# EAGLE design MBHP_CORE_STM32F4 (EAGLE 7.2.0)
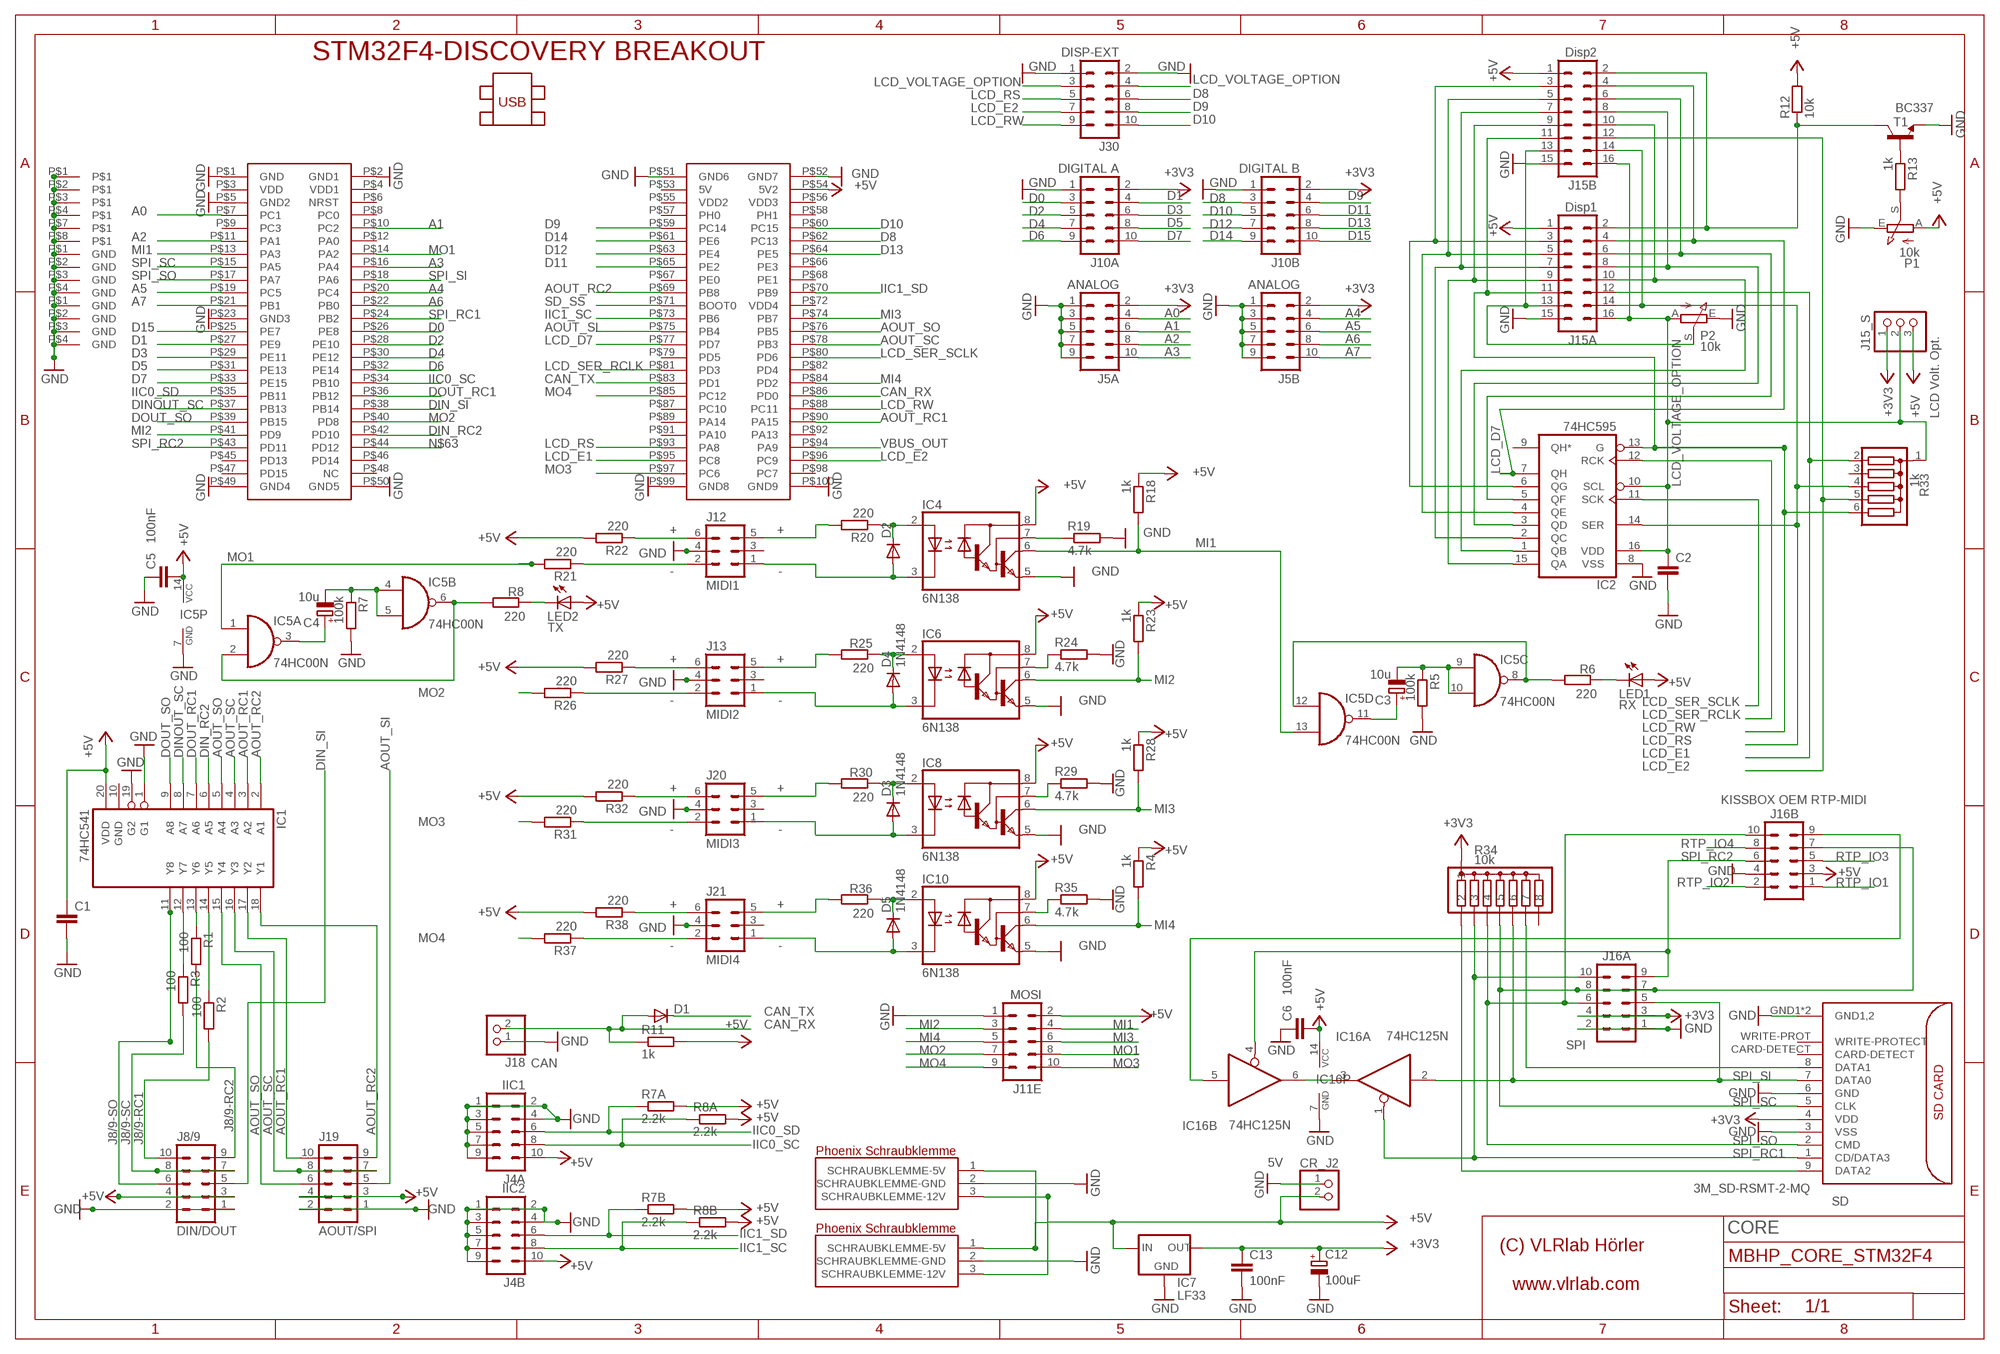
[diagram p0: schematic, sheet 1]

## Parts
C1  C-EU025-025X050  [C025-025X050]
C2  C-EU025-025X050  [C025-025X050]
C3  10u  CPOL-EUE2.5-6  [E2,5-6]
C4  10u  CPOL-EUE2.5-6  [E2,5-6]
C5  100nF  C-EU025-025X050  [C025-025X050]
C6  100nF  C-EU025-025X050  [C025-025X050]
C12  100uF  CPOL-EUE5-10.5  [E5-10,5]
C13  100nF  C-EU025-025X050  [C025-025X050]
CR_J2  5V  PINHD-1X2  [1X02]
D1  1N4148  1N4148DO35-7  [DO35-7]
D2  1N4148DO35-7  [DO35-7]
D3  1N4148  1N4148DO35-7  [DO35-7]
D4  1N4148  1N4148DO35-7  [DO35-7]
D5  1N4148  1N4148DO35-7  [DO35-7]
IC1  74HC541  [DIL20]
IC2  74HC595  [DIL16]
IC4  6N138  6N138DIL  [DIL08]
IC5  74HC00N  74AC00N  [DIL14]
IC6  6N138  6N138DIL  [DIL08]
IC7  LF33  [TO220]
IC8  6N138  6N138DIL  [DIL08]
IC10  6N138  6N138DIL  [DIL08]
IC16  74HC125N  [DIL14]
J1A  PT-1.5/3  [PT-1.5/3-5.0]
J1B  PT-1.5/3  [PT-1.5/3-5.0]
J4A  IIC1  ML10  [ML10]
J4B  IIC2  ML10  [ML10]
J5A  ANALOG  ML10  [ML10]
J5B  ANALOG  ML10  [ML10]
J8/9  DIN/DOUT  ML10  [ML10]
J10A  DIGITAL A  ML10  [ML10]
J10B  DIGITAL B  ML10  [ML10]
J11E  MOSI  ML10  [ML10]
J12  MIDI1  ML6  [ML6]
J13  MIDI2  ML6  [ML6]
J15_S  LCD Volt. Opt.  PINHD-1X3  [1X03]
J15A  Disp1  ML16  [ML16]
J15B  Disp2  ML16  [ML16]
J16A  SPI  ML10  [ML10]
J16B  KISSBOX OEM RTP-MIDI  ML10  [ML10]
J18  CAN  PINHD-1X2  [1X02]
J19  AOUT/SPI  ML10  [ML10]
J20  MIDI3  ML6  [ML6]
J21  MIDI4  ML6  [ML6]
J30  DISP-EXT  ML10  [ML10]
LED1  RX  LED3MM  [LED3MM]
LED2  TX  LED3MM  [LED3MM]
OUTLINE  MIDIBOX_FULL  [MIDIBOX14X12]
P1  10k  PHIER_6MM  [6MM_V]
P2  10k  PHIER_6MM  [6MM_V]
R1  100  R-EU_0204/7  [0204/7]
R2  100  R-EU_0204/7  [0204/7]
R3  100  R-EU_0204/7  [0204/7]
R4  1k  R-EU_0204/7  [0204/7]
R5  100k  R-EU_0204/7  [0204/7]
R6  220  R-EU_0204/7  [0204/7]
R7  100k  R-EU_0204/7  [0204/7]
R7A  2.2k  R-EU_0204/7  [0204/7]
R7B  2.2k  R-EU_0204/7  [0204/7]
R8  220  R-EU_0204/7  [0204/7]
R8A  2.2k  R-EU_0204/7  [0204/7]
R8B  2.2k  R-EU_0204/7  [0204/7]
R11  1k  R-EU_0204/7  [0204/7]
R12  10k  R-EU_0204/7  [0204/7]
R13  1k  R-EU_0204/7  [0204/7]
R18  1k  R-EU_0204/7  [0204/7]
R19  4.7k  R-EU_0204/7  [0204/7]
R20  220  R-EU_0204/7  [0204/7]
R21  220  R-EU_0204/7  [0204/7]
R22  220  R-EU_0204/7  [0204/7]
R23  1k  R-EU_0204/7  [0204/7]
R24  4.7k  R-EU_0204/7  [0204/7]
R25  220  R-EU_0204/7  [0204/7]
R26  220  R-EU_0204/7  [0204/7]
R27  220  R-EU_0204/7  [0204/7]
R28  1k  R-EU_0204/7  [0204/7]
R29  4.7k  R-EU_0204/7  [0204/7]
R30  220  R-EU_0204/7  [0204/7]
R31  220  R-EU_0204/7  [0204/7]
R32  220  R-EU_0204/7  [0204/7]
R33  1k  4306R  [SIL6]
R34  10k  7R_ARRAY  [SIL8]
R35  4.7k  R-EU_0204/7  [0204/7]
R36  220  R-EU_0204/7  [0204/7]
R37  220  R-EU_0204/7  [0204/7]
R38  220  R-EU_0204/7  [0204/7]
SD  3M_SD-RSMT-2-MQ  [3M_SD-RSMT-2-MQ]
STM32F4DISCOVERY  STM32F4-DISCOVERY  [STM32F4-DISCOVERY]
T1  BC337  [TO92]
U$1  KEYSTONE_SCREW_TERMINAL  [KEYSTONE_SCREW_TERMINAL]
U$2  KEYSTONE_SCREW_TERMINAL  [KEYSTONE_SCREW_TERMINAL]

## Nets
+3V3 [SDcard]: C12.+ C13.1 IC7.OUT J5A.2 J5B.2 J10A.2 J10B.2 J15_S.1 J16A.3 J16A.4 R34.1 SD.4(VDD)
+5V [VDD]: C1.1 C5.2 C6.2 CR_J2.2 IC1.20(VDD) IC4.8(VCC) IC5.14(P:VCC) IC6.8(VCC) IC7.IN IC8.8(VCC) IC10.8(VCC) IC16.14(P:VCC) J1A.1(SCHRAUBKLEMME-5V) J1B.1(SCHRAUBKLEMME-5V) J4A.10 J4B.10 J8/9.3 J8/9.4 J11E.2 J15_S.3 J15A.1 J15B.1 J16B.3 J19.3 J19.4 LED1.A LED2.A P1.A R4.1 R7A.2 R7B.2 R8A.2 R8B.2 R11.2 R12.2 R18.1 R22.2 R23.1 R27.2 R28.1 R32.2 R38.2 STM32F4DISCOVERY.P$54(5V2)
+12V1 [10V]: J1A.3(SCHRAUBKLEMME-12V) J1B.3(SCHRAUBKLEMME-12V)
A0: J5A.4 STM32F4DISCOVERY.P$7(PC1)
A1: J5A.6 STM32F4DISCOVERY.P$10(PC2)
A2: J5A.8 STM32F4DISCOVERY.P$11(PA1)
A3: J5A.10 STM32F4DISCOVERY.P$16(PA4)
A4: J5B.4 STM32F4DISCOVERY.P$20(PC4)
A5: J5B.6 STM32F4DISCOVERY.P$19(PC5)
A6: J5B.8 STM32F4DISCOVERY.P$22(PB0)
A7: J5B.10 STM32F4DISCOVERY.P$21(PB1)
AOUT_RC1: IC1.3(A2) IC1.17(Y2) J19.10 STM32F4DISCOVERY.P$90(PA15)
AOUT_RC2: IC1.2(A1) IC1.18(Y1) J19.9 STM32F4DISCOVERY.P$69(PB8)
AOUT_SC: IC1.4(A3) IC1.16(Y3) J19.7 J19.8 STM32F4DISCOVERY.P$78(PB3)
AOUT_SI: J19.5 STM32F4DISCOVERY.P$75(PB4)
AOUT_SO: IC1.5(A4) IC1.15(Y4) J19.6 STM32F4DISCOVERY.P$76(PB5)
CAN_RX: D1.A J18.2 R11.1 STM32F4DISCOVERY.P$86(PD0)
CAN_TX: D1.C STM32F4DISCOVERY.P$83(PD1)
CR_M1-: D2.A IC4.3(C) J12.1
CR_M2+$1: D2.C IC4.2(A) R20.1
D0: J10A.3 STM32F4DISCOVERY.P$26(PE8)
D1: J10A.4 STM32F4DISCOVERY.P$27(PE9)
D2: J10A.5 STM32F4DISCOVERY.P$28(PE10)
D3: J10A.6 STM32F4DISCOVERY.P$29(PE11)
D4: J10A.7 STM32F4DISCOVERY.P$30(PE12)
D5: J10A.8 STM32F4DISCOVERY.P$31(PE13)
D6: J10A.9 STM32F4DISCOVERY.P$32(PE14)
D7: J10A.10 STM32F4DISCOVERY.P$33(PE15)
D8: J10B.3 J30.6 STM32F4DISCOVERY.P$62(PC13)
D9: J10B.4 J30.8 STM32F4DISCOVERY.P$59(PC14)
D10: J10B.5 J30.10 STM32F4DISCOVERY.P$60(PC15)
D11: J10B.6 STM32F4DISCOVERY.P$65(PE2)
D12: J10B.7 STM32F4DISCOVERY.P$63(PE4)
D13: J10B.8 STM32F4DISCOVERY.P$64(PE5)
D14: J10B.9 STM32F4DISCOVERY.P$61(PE6)
D15: J10B.10 STM32F4DISCOVERY.P$25(PE7)
DIN_RC2: IC1.6(A5) STM32F4DISCOVERY.P$42(PD10)
DIN_SI: J8/9.5 STM32F4DISCOVERY.P$38(PB14)
DINOUT_SC: IC1.8(A7) STM32F4DISCOVERY.P$37(PB13)
DOUT_RC1: IC1.7(A6) STM32F4DISCOVERY.P$36(PB12)
DOUT_SO: IC1.9(A8) STM32F4DISCOVERY.P$39(PB15)
GND: C1.2 C2.2 C5.1 C6.1 C12.- C13.2 CR_J2.1 IC1.1(G1) IC1.19(G2) IC2.8(VSS) IC4.5(GND) IC5.7(P:GND) IC6.5(GND) IC7.GND IC8.5(GND) IC10.5(GND) IC16.7(P:GND) J1A.2(SCHRAUBKLEMME-GND) J1B.2(SCHRAUBKLEMME-GND) J4A.1 J4A.2 J4A.3 J4A.4 J4A.5 J4A.7 J4A.9 J4B.1 J4B.2 J4B.3 J4B.4 J4B.5 J4B.7 J4B.9 J5A.1 J5A.3 J5A.5 J5A.7 J5A.9 J5B.1 J5B.3 J5B.5 J5B.7 J5B.9 J8/9.1 J8/9.2 J10A.1 J10B.1 J11E.1 J12.4 J13.4 J15A.15 J15B.15 J16A.1 J16A.2 J16B.4 J18.1 J19.1 J19.2 J20.4 J21.4 J30.1 J30.2 OUTLINE.P$1 OUTLINE.P$2 OUTLINE.P$3 OUTLINE.P$4 OUTLINE.P$7 OUTLINE.P$8 P1.E P2.E R5.2 R7.2 R19.2 R24.2 R29.2 R35.2 SD.3(VSS) SD.6(GND) SD.GND1(GND1,2) SD.GND2(GND1,2) STM32F4DISCOVERY.P$1(GND) STM32F4DISCOVERY.P$2(GND1) STM32F4DISCOVERY.P$5(GND2) STM32F4DISCOVERY.P$23(GND3) STM32F4DISCOVERY.P$49(GND4) STM32F4DISCOVERY.P$50(GND5) STM32F4DISCOVERY.P$51(GND6) STM32F4DISCOVERY.P$52(GND7) STM32F4DISCOVERY.P$99(GND8) STM32F4DISCOVERY.P$100(GND9) T1.1(E) U$1.P$1 U$1.P$2 U$1.P$3 U$1.P$4 U$2.P$1 U$2.P$2 U$2.P$3 U$2.P$4
IIC0_SC: J4A.8 R8A.1 STM32F4DISCOVERY.P$34(PB10)
IIC0_SD: J4A.6 R7A.1 STM32F4DISCOVERY.P$35(PB11)
IIC1_SC: J4B.8 R8B.1 STM32F4DISCOVERY.P$73(PB6)
IIC1_SD: J4B.6 R7B.1 STM32F4DISCOVERY.P$70(PB9)
J8/9-RC1: J8/9.10 R2.2
J8/9-RC2: J8/9.9 R1.2
J8/9-SC: J8/9.7 J8/9.8 R3.2
J8/9-SO: IC1.11(Y8) J8/9.6
LCD_D7: IC2.7(QH) J15A.4 J15B.4 STM32F4DISCOVERY.P$77(PD7)
LCD_E1: J15A.12 R33.2 STM32F4DISCOVERY.P$95(PC8)
LCD_E2: J15B.12 J30.7 R33.5 STM32F4DISCOVERY.P$96(PC9)
LCD_RS: IC2.14(SER) J15A.14 J15B.14 J30.5 R33.4 STM32F4DISCOVERY.P$93(PA8)
LCD_RW: IC2.13(G) J15A.11 J15B.11 J30.9 R33.6 STM32F4DISCOVERY.P$88(PC11)
LCD_SER_RCLK: IC2.12(RCK) STM32F4DISCOVERY.P$81(PD3)
LCD_SER_SCLK: IC2.11(SCK) STM32F4DISCOVERY.P$80(PD6)
LCD_VOLTAGE_OPTION [VDD]: C2.1 IC2.10(SCL) IC2.16(VDD) J15_S.2 J15A.16 J15B.16 J30.3 J30.4 P2.A R33.1
MF_M+ZULEITUNG: J13.5 R25.2
MF_M+ZULEITUNG1: J20.5 R30.2
MF_M+ZULEITUNG2: J21.5 R36.2
MF_M-ZULEITUNG: D4.A IC6.3(C) J13.1
MF_M-ZULEITUNG1: D3.A IC8.3(C) J20.1
MF_M-ZULEITUNG2: D5.A IC10.3(C) J21.1
MI1: IC4.6(VO) IC5.13(D:I1) J11E.4 R18.2 STM32F4DISCOVERY.P$13(PA3)
MI2: IC6.6(VO) J11E.3 R23.2 STM32F4DISCOVERY.P$41(PD9)
MI3: IC8.6(VO) J11E.6 R28.2 STM32F4DISCOVERY.P$74(PB7)
MI4: IC10.6(VO) J11E.5 R4.2 STM32F4DISCOVERY.P$84(PD2)
MO1: IC5.1(A:I0) J11E.8 R21.2 STM32F4DISCOVERY.P$14(PA2)
MO2: J11E.7 R26.2 STM32F4DISCOVERY.P$40(PD8)
MO3: J11E.10 R31.2 STM32F4DISCOVERY.P$97(PC6)
MO4: J11E.9 R37.2 STM32F4DISCOVERY.P$85(PC12)
N$1: IC2.6(QG) J15A.3 J15B.3
N$2: IC2.5(QF) J15A.6 J15B.6
N$3: IC2.4(QE) J15A.5 J15B.5
N$4: IC2.3(QD) J15A.8 J15B.8
N$5: R34.2 SD.9(DATA2)
N$6: IC16.5(B:I) J16B.9
N$7: R34.7 SD.8(DATA1)
N$8: IC2.2(QC) J15A.7 J15B.7
N$9: IC2.1(QB) J15A.10 J15B.10
N$10: IC2.15(QA) J15A.9 J15B.9
N$11: IC4.7(VB) R19.1
N$12: J15A.13 J15B.13 P2.S
N$13: IC16.3(A:O) IC16.6(B:O)
N$14: P1.S R13.2
N$15: R13.1 T1.2(B)
N$16: J12.6 R22.1
N$18: J15A.2 J15B.2 R12.1 T1.3(C)
N$19: D4.C IC6.2(A) R25.1
N$20: J12.5 R20.2
N$21: C3.- IC5.9(C:I0) IC5.10(C:I1) R5.1
N$22: C3.+ IC5.11(D:O)
N$23: IC5.8(C:O) IC5.12(D:I0) R6.2
N$24: J12.3
N$25: J13.6 R27.1
N$26: J13.2 R26.1
N$27: LED1.K(C) R6.1
N$28: D3.C IC8.2(A) R30.1
N$29: IC8.7(VB) R29.1
N$30: J20.6 R32.1
N$31: J20.2 R31.1
N$32: D5.C IC10.2(A) R36.1
N$33: IC10.7(VB) R35.1
N$34: J21.6 R38.1
N$35: J21.2 R37.1
N$36: IC5.4(B:I0) IC5.5(B:I1)
N$37: C4.- R7.1
N$39: C4.+ IC5.3(A:O)
N$40: IC5.2(A:I1) IC5.6(B:O) R8.2
N$42: LED2.K(C) R8.1
N$63: STM32F4DISCOVERY.P$44(PD12)
N$81: J12.2 R21.1
N$99: IC6.7(VB) R24.1
RC-I-: IC1.14(Y5) R2.1
RC-O-: IC1.13(Y6) R1.1
RTP_IO1: J16B.1
RTP_IO2: J16B.2
RTP_IO3: J16B.5
RTP_IO4: J16B.8
SC-: IC1.12(Y7) R3.1
SD_SS: STM32F4DISCOVERY.P$71(BOOT0)
SPI_RC1: IC16.1(A:OE) J16A.10 R34.3 SD.1(CD/DATA3) STM32F4DISCOVERY.P$24(PB2)
SPI_RC2: IC16.4(B:OE) J16A.9 J16B.6 STM32F4DISCOVERY.P$43(PD11)
SPI_SC: J16A.7 J16A.8 J16B.7 R34.5 SD.5(CLK) STM32F4DISCOVERY.P$15(PA5)
SPI_SI: IC16.2(A:I) J16A.5 R34.6 SD.7(DATA0) STM32F4DISCOVERY.P$18(PA6)
SPI_SO: J16A.6 J16B.10 R34.4 SD.2(CMD) STM32F4DISCOVERY.P$17(PA7)
VBUS_OUT: STM32F4DISCOVERY.P$94(PA9)
Unconnected: IC2.9(QH*) IC16.8(C:O) IC16.9(C:I) IC16.10(C:OE) IC16.11(D:O) IC16.12(D:I) IC16.13(D:OE) J13.3 J20.3 J21.3 R33.3 R34.8 SD.CARD-DETECT SD.WRITE-PROT(WRITE-PROTECT) STM32F4DISCOVERY.P$3(VDD) STM32F4DISCOVERY.P$4(VDD1) STM32F4DISCOVERY.P$6(NRST) STM32F4DISCOVERY.P$8(PC0) STM32F4DISCOVERY.P$9(PC3) STM32F4DISCOVERY.P$12(PA0) STM32F4DISCOVERY.P$45(PD13) STM32F4DISCOVERY.P$46(PD14) STM32F4DISCOVERY.P$47(PD15) STM32F4DISCOVERY.P$48(NC) STM32F4DISCOVERY.P$53(5V) STM32F4DISCOVERY.P$55(VDD2) STM32F4DISCOVERY.P$56(VDD3) STM32F4DISCOVERY.P$57(PH0) STM32F4DISCOVERY.P$58(PH1) STM32F4DISCOVERY.P$66(PE3) STM32F4DISCOVERY.P$67(PE0) STM32F4DISCOVERY.P$68(PE1) STM32F4DISCOVERY.P$72(VDD4) STM32F4DISCOVERY.P$79(PD5) STM32F4DISCOVERY.P$82(PD4) STM32F4DISCOVERY.P$87(PC10) STM32F4DISCOVERY.P$89(PA14) STM32F4DISCOVERY.P$91(PA10) STM32F4DISCOVERY.P$92(PA13) STM32F4DISCOVERY.P$98(PC7)

## Notes on the sheet
- + | +
- - | -
- + | +
- - | -
- + | +
- - | -
- + | +
- - | -
- CORE

## Power pins joined to a net without a drawn wire
GND: IC1.10(GND)

## Library data of the parts
C1 C2 C5 C6 C13 = rcl:C-EU: CAPACITOR, European symbol
C3 C4 C12 = rcl:CPOL-EU: POLARIZED CAPACITOR, European symbol
CR_J2 J18 = pinhead_Ivan:PINHD-1X2: PIN HEADER
D1-D5 = diode:1N4148: DIODE high speed (Philips)
IC1 = 595-541-165-uln2803:74HC541
IC2 = 74-595:74HC595
IC4 IC6 IC8 IC10 = 6N138:6N138DIL
IC5 = 74xx-eu:74*00: Quad 2-input NAND gate
IC7 = LF33:LF33
IC16 = 74xx-eu:74*125: Quad bus BUFFER, 3-state
J1A J1B = Phonenix Contacts:PT-1.5/3
J4A J4B J5A J5B J8/9 J10A J10B J11E J16A J16B J19 J30 = con-harting-ml:ML10: HARTING; OC_FARNELL: unknown; OC_NEWARK: unknown
J12 J13 J20 J21 = con-harting-ml:ML6: HARTING; OC_FARNELL: unknown; OC_NEWARK: unknown
J15_S = pinhead_Ivan:PINHD-1X3: PIN HEADER
J15A J15B = con-ml:ML16: HARTING; OC_FARNELL: unknown; OC_NEWARK: unknown
LED1 LED2 = led:LED: LED OSRAM: - CHIPLED LG R971, LG N971, LY N971, LG Q971, LY Q971, LO R971, LY R971 LH N974, LH R974 LS Q976, LO Q976, LY Q976 LO Q996 - Hyper CHIPLED LW Q18S LB Q993, LB Q99A, LB R99A - SideLED LS A670, LO A670, LY A670, LG A670, LP A670 LB A673, LV A673, LT A673, LW A673 LH A674 LY A675 LS A676, LA A676, LO A676, LY A676, LW A676 LS A679, LY A679, LG A679 - Hyper Micro SIDELED® LS Y876, LA Y876, LO Y876, LY Y876 LT Y87S - SmartLED LW L88C, LW L88S LB L89C, LB L89S, LG L890 LS L89K, LO L89K, LY L89K LS L896, LA L896, LO L896, LY L896 - TOPLED LS T670, LO T670, LY T670, LG T670, LP T670 LSG T670, LSP T670, LSY T670, LOP T670, LYG T670 LG T671, LOG T671, LSG T671 LB T673, LV T673, LT T673, LW T673 LH T674 LS T676, LA T676, LO T676, LY T676, LB T676, LH T676, LSB T676, LW T676 LB T67C, LV T67C, LT T67C, LS T67K, LO T67K, LY T67K, LW E67C LS E67B, LA E67B, LO E67B, LY E67B, LB E67C, LV E67C, LT E67C LW T67C LS T679, LY T679, LG T679 LS T770, LO T770, LY T770, LG T770, LP T770 LB T773, LV T773, LT T773, LW T773 LH T774 LS E675, LA E675, LY E675, LS T675 LS T776, LA T776, LO T776, LY T776, LB T776 LHGB T686 LT T68C, LB T68C - Hyper Mini TOPLED® LB M676 - Mini TOPLED Santana® LG M470 LS M47K, LO M47K, LY M47K Source: http://www.osram.convergy.de LUXEON: - LUMILED® LXK2-PW12-R00, LXK2-PW12-S00, LXK2-PW14-U00, LXK2-PW14-V00 LXK2-PM12-R00, LXK2-PM12-S00, LXK2-PM14-U00 LXK2-PE12-Q00, LXK2-PE12-R00, LXK2-PE12-S00, LXK2-PE14-T00, LXK2-PE14-U00 LXK2-PB12-K00, LXK2-PB12-L00, LXK2-PB12-M00, LXK2-PB14-N00, LXK2-PB14-P00, LXK2-PB14-Q00 LXK2-PR12-L00, LXK2-PR12-M00, LXK2-PR14-Q00, LXK2-PR14-R00 LXK2-PD12-Q00, LXK2-PD12-R00, LXK2-PD12-S00 LXK2-PH12-R00, LXK2-PH12-S00 LXK2-PL12-P00, LXK2-PL12-Q00, LXK2-PL12-R00 Source: www.luxeon.com KINGBRIGHT: KA-3528ASYC Source: www.kingbright.com
OUTLINE = Frames_VLR:MIDIBOX_FULL
P1 P2 = Potentiometer 6mm:PHIER_6MM
R1-R3 R7A R7B R8A R8B = rcl:R-EU_: RESISTOR, European symbol
R4-R8 R11-R13 R18-R32 R35-R38 = resistor:R-EU_: RESISTOR, European symbol
R33 = Bourns Resistor Array:4306R
R34 = Bourns Resistor Array:7R_ARRAY
SD = Memory:3M_SD-RSMT-2-MQ
STM32F4DISCOVERY = STM32F4-DISCOVERY:STM32F4-DISCOVERY
T1 = transistor:BC337: NPN TRANSISTOR
U$1 U$2 = holes_Ivan:KEYSTONE_SCREW_TERMINAL

## Net classes
0 default: width 0.254 mm, drill 0.33 mm, clearance 0.254 mm
1 VDD: width 0.61 mm, drill 0.33 mm, clearance 0.406 mm to class 0, clearance 0.406 mm
2 10V: width 1.016 mm, drill 0.33 mm, clearance 0.406 mm to class 0, clearance 0.406 mm to class 1, clearance 0.254 mm
3 SDcard: width 0.406 mm, drill 0.33 mm, clearance 0.406 mm to class 0, clearance 0.406 mm to class 1, clearance 0.406 mm to class 2, clearance 0.406 mm

## Board
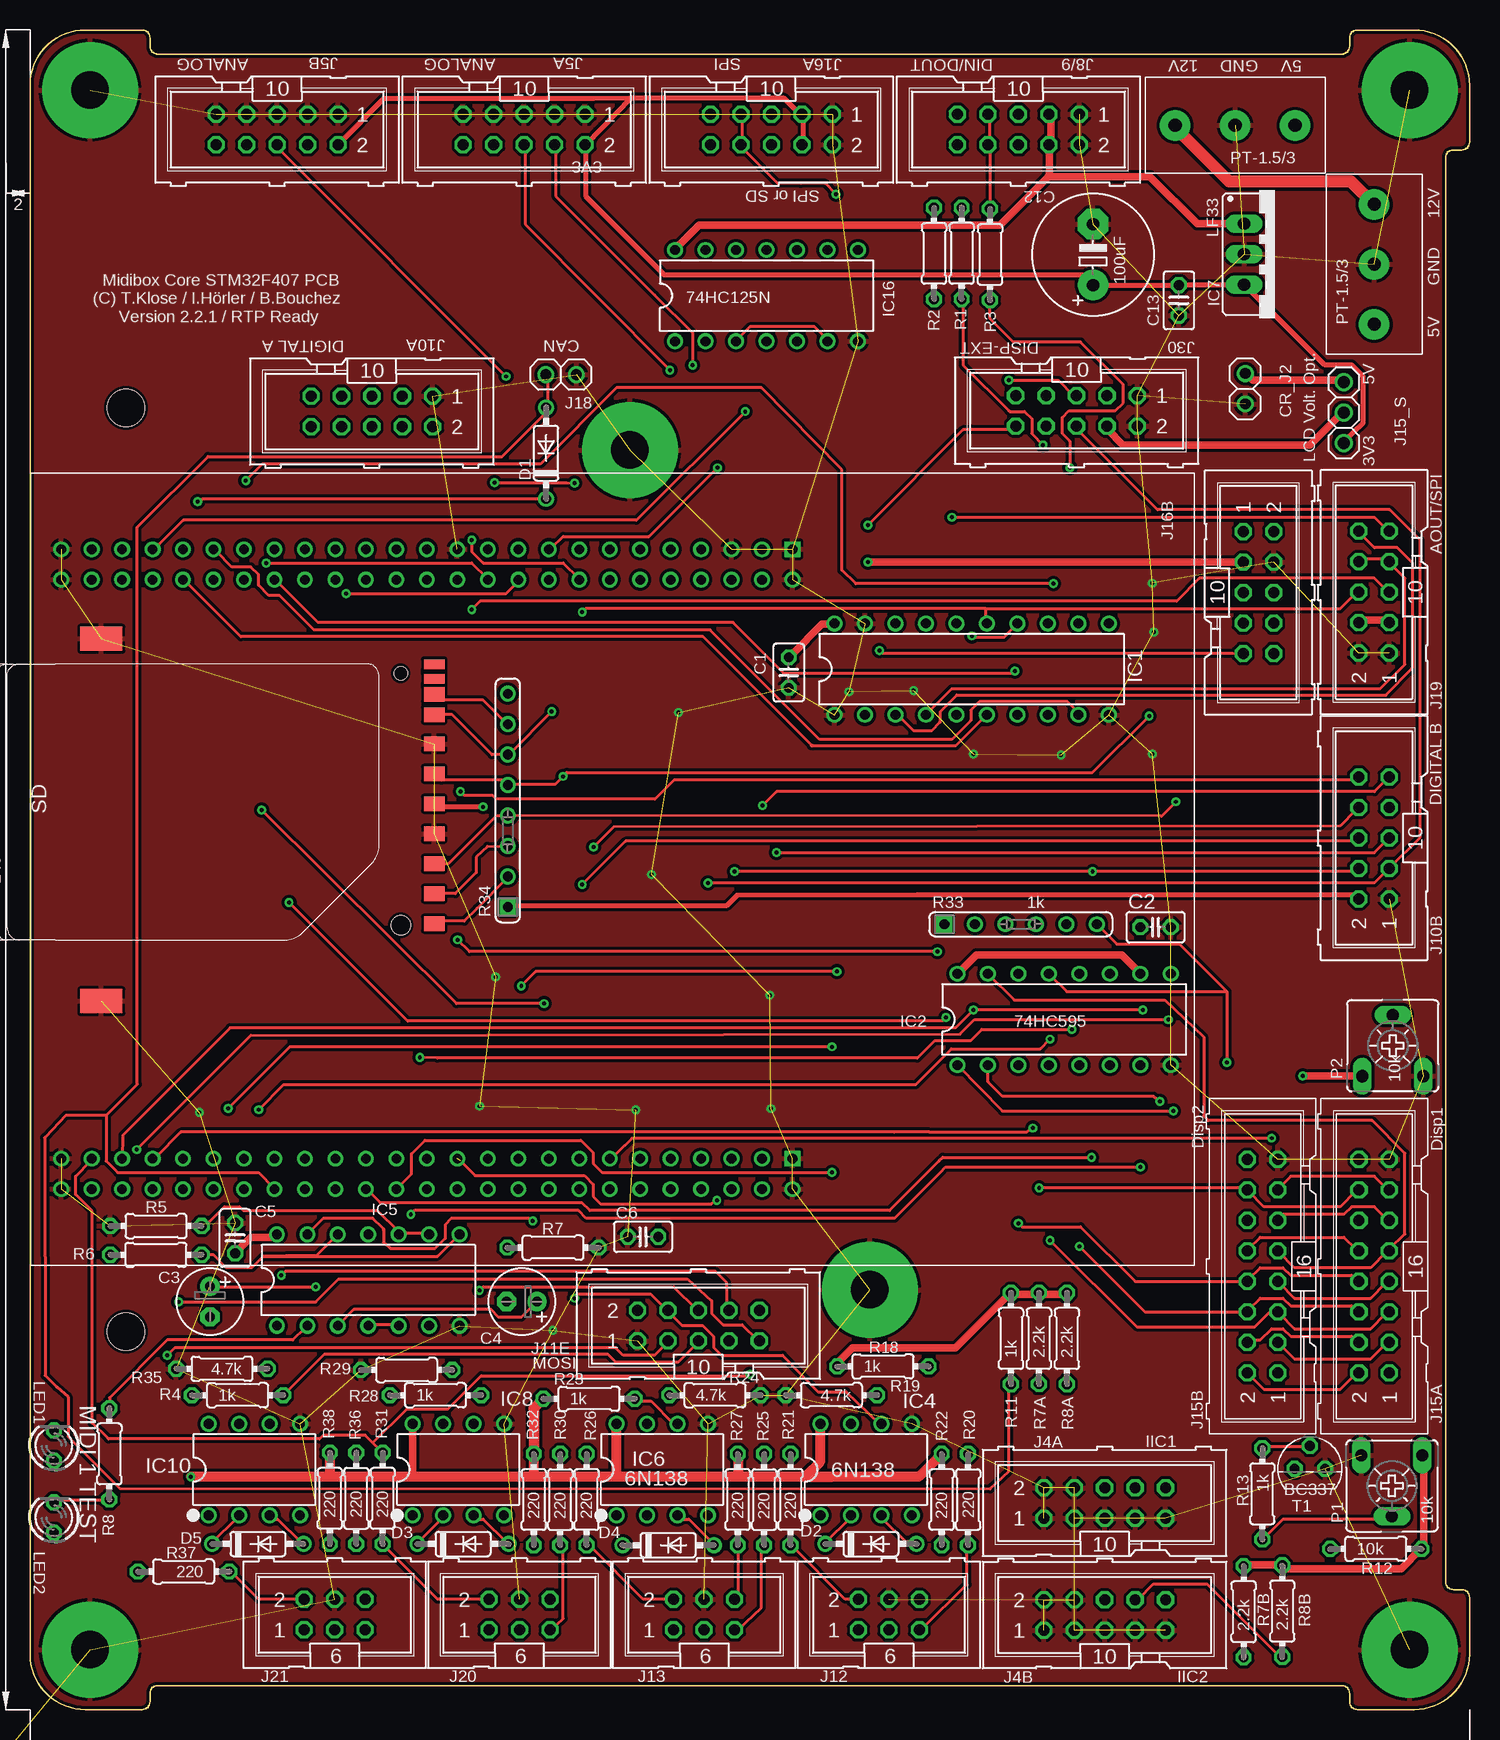
[diagram p1: board, top side]
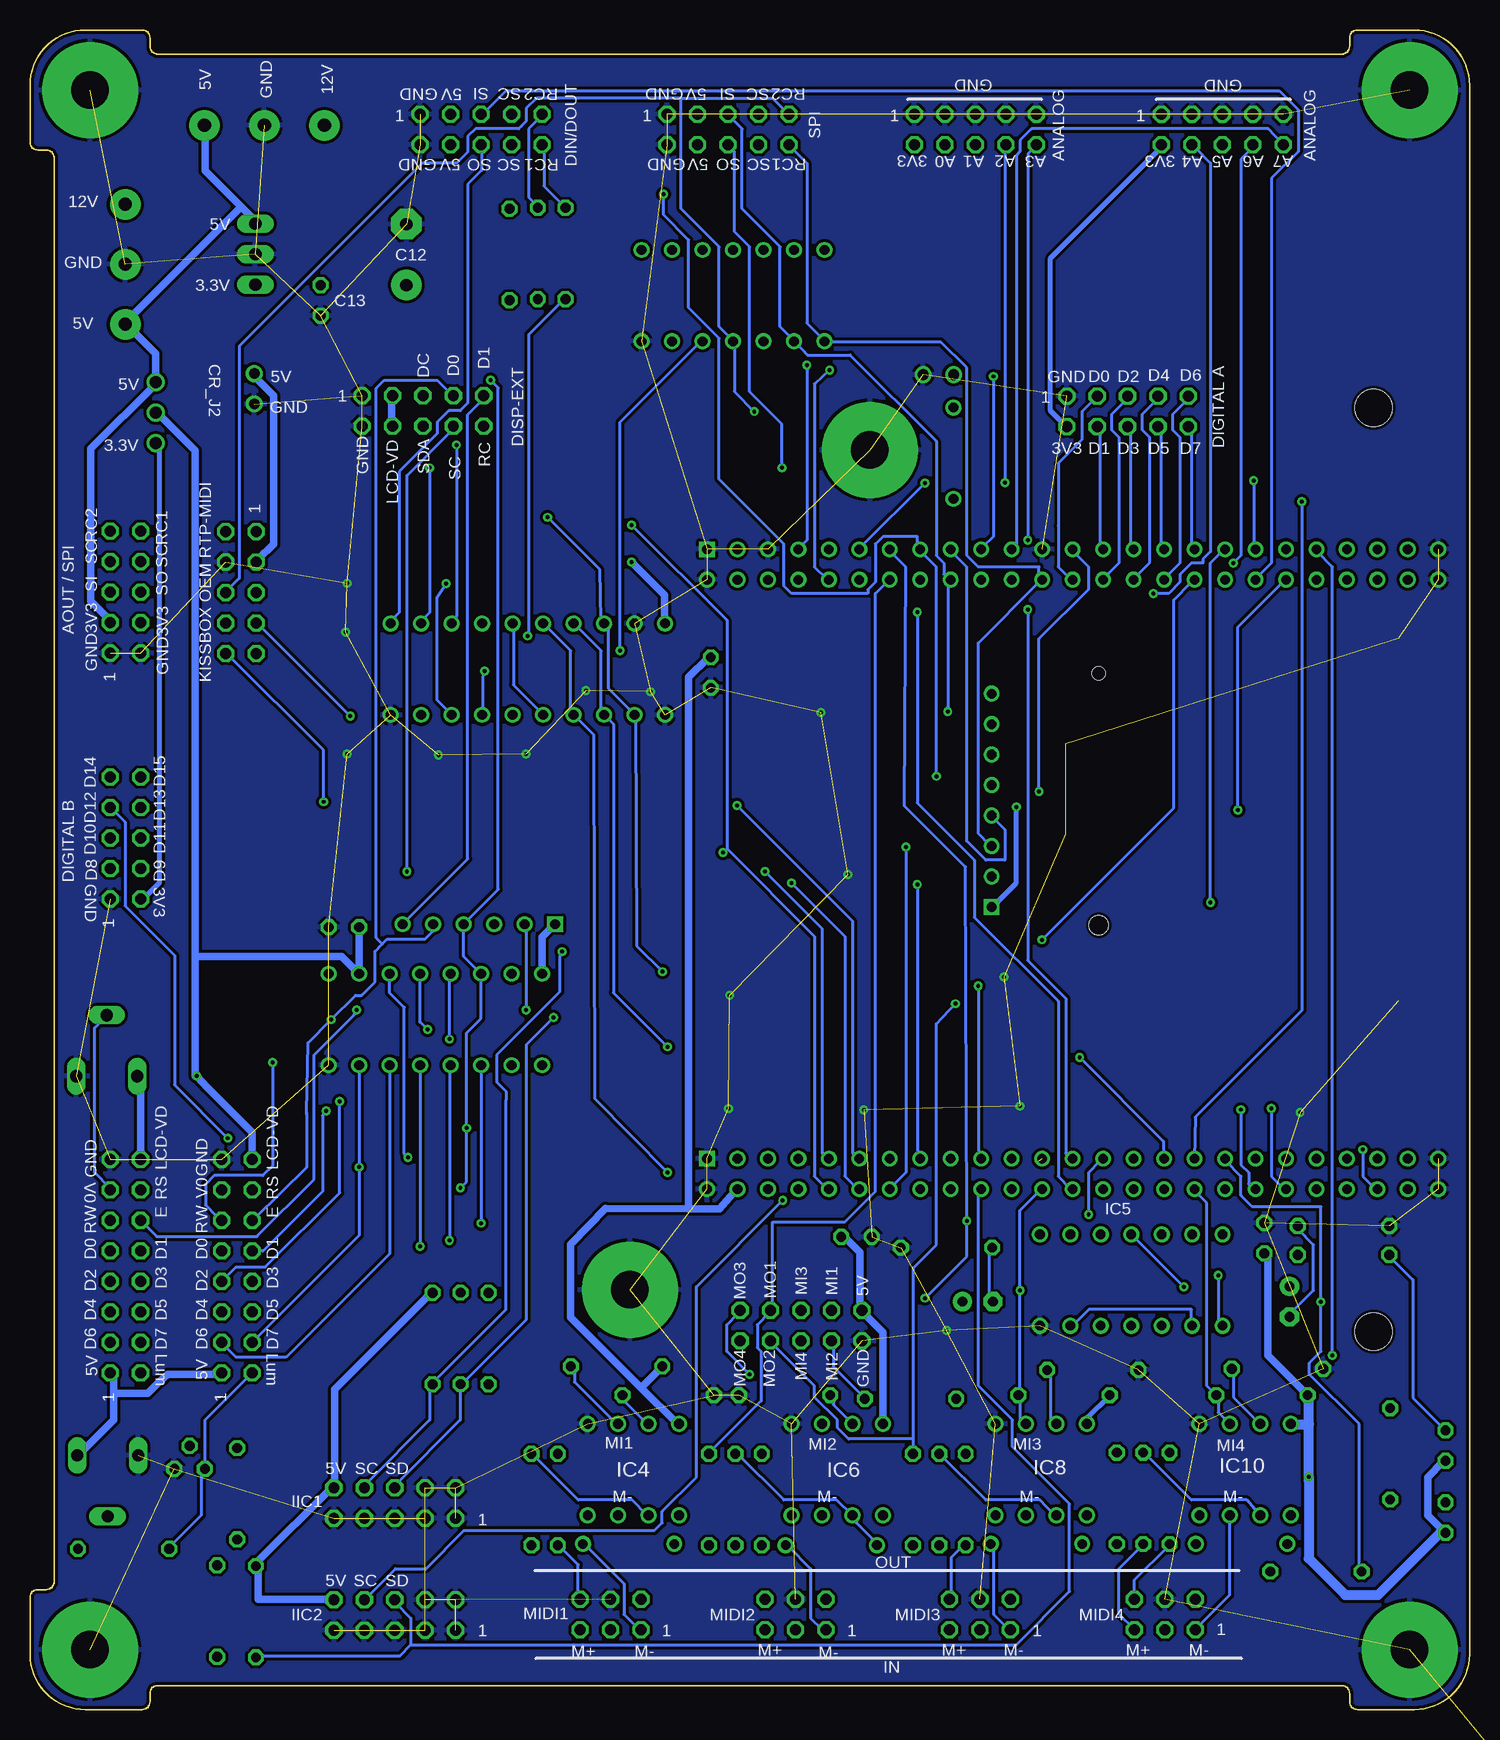
[diagram p2: board, bottom side, seen from below]

Size 120 x 140 mm. Coordinates in mm from the lower left corner, seen from the top.
Copper layers (1*16): Top 0.035mm / dielectric 1.5mm / Bottom 0.035mm
Design rules "makePCB *": minimum track width 10mil, minimum drill 13mil, track to track 10mil, track to pad 8mil, pad to pad 8mil, via to via 8mil, smd to smd 8mil, copper to edge 10mil, drill to drill 10mil, minimum pad ring 10mil, minimum via ring 8mil, stop-mask expansion 4mil, vias tented up to drill 0mil, thermal gap 10mil
Holes 3.1 mm at 8,108.5 8,31.5

### Footprints (pad centres in the part's own frame; a part is rotated, then mirrored left to right if it is on the bottom)
C025-025X050 = drill 0.813 octagon: 1 -1.27,0; 2 1.27,0
E2,5-6 = drill 0.813 pad 1.6: + -1.27,0 | drill 0.813 pad 1.6 octagon: - 1.27,0
E5-10,5 = drill 1.016 pad 2.54: + -2.54,0 | drill 1.016 pad 2.54 octagon: - 2.54,0
1X02 = drill 0.9: 1 -1.27,0; 2 1.27,0
DO35-7 = drill 0.813: A 3.81,0; C -3.81,0
DIL20 = drill 0.813: 1 -11.43,-3.81; 2 -8.89,-3.81; 3 -6.35,-3.81; 4 -3.81,-3.81; 5 -1.27,-3.81; 6 1.27,-3.81; 7 3.81,-3.81; 8 6.35,-3.81; 9 8.89,-3.81; 10 11.43,-3.81; 11 11.43,3.81; 12 8.89,3.81; 13 6.35,3.81; 14 3.81,3.81; 15 1.27,3.81; 16 -1.27,3.81; 17 -3.81,3.81; 18 -6.35,3.81; 19 -8.89,3.81; 20 -11.43,3.81
DIL16 = drill 0.813: 1 -8.89,-3.81; 2 -6.35,-3.81; 3 -3.81,-3.81; 4 -1.27,-3.81; 5 1.27,-3.81; 6 3.81,-3.81; 7 6.35,-3.81; 8 8.89,-3.81; 9 8.89,3.81; 10 6.35,3.81; 11 3.81,3.81; 12 1.27,3.81; 13 -1.27,3.81; 14 -3.81,3.81; 15 -6.35,3.81; 16 -8.89,3.81
DIL08 = drill 0.813: 1 -3.81,-3.81; 2 -1.27,-3.81; 3 1.27,-3.81; 4 3.81,-3.81; 5 3.81,3.81; 6 1.27,3.81; 7 -1.27,3.81; 8 -3.81,3.81
DIL14 = drill 0.813: 1 -7.62,-3.81; 2 -5.08,-3.81; 3 -2.54,-3.81; 4 0,-3.81; 5 2.54,-3.81; 6 5.08,-3.81; 7 7.62,-3.81; 8 7.62,3.81; 9 5.08,3.81; 10 2.54,3.81; 11 0,3.81; 12 -2.54,3.81; 13 -5.08,3.81; 14 -7.62,3.81
TO220 = drill 1.016 long: GND 0,0; IN -2.54,0; OUT 2.54,0
PT-1.5/3-5.0 = drill 1.1 pad 2.54: 1 5,0; 2 0,0; 3 -5,0
ML10 = drill 0.914 octagon: 1 -5.08,-1.27; 2 -5.08,1.27; 3 -2.54,-1.27; 4 -2.54,1.27; 5 0,-1.27; 6 0,1.27; 7 2.54,-1.27; 8 2.54,1.27; 9 5.08,-1.27; 10 5.08,1.27
ML6 = drill 0.914 octagon: 1 -2.54,-1.27; 2 -2.54,1.27; 3 0,-1.27; 4 0,1.27; 5 2.54,-1.27; 6 2.54,1.27
1X03 = drill 1.016: 1 -2.54,0; 2 0,0; 3 2.54,0
ML16 = drill 0.914 octagon: 1 -8.89,-1.27; 2 -8.89,1.27; 3 -6.35,-1.27; 4 -6.35,1.27; 5 -3.81,-1.27; 6 -3.81,1.27; 7 -1.27,-1.27; 8 -1.27,1.27; 9 1.27,-1.27; 10 1.27,1.27; 11 3.81,-1.27; 12 3.81,1.27; 13 6.35,-1.27; 14 6.35,1.27; 15 8.89,-1.27; 16 8.89,1.27
LED3MM = drill 0.813 octagon: A -1.27,0; K 1.27,0
MIDIBOX14X12 = drill 3.1 pad 8: P$1 5,135; P$2 50,105; P$3 70,35; P$4 5,5; P$7 115,135; P$8 115,5
6MM_V = drill 1.016 long: A -2.54,-2.54; E 2.54,-2.54; S 0,2.54
0204/7 = drill 0.813 octagon: 1 -3.81,0; 2 3.81,0
SIL6 = drill 0.813 square: 1 -6.35,0 | drill 0.813: 2 -3.81,0; 3 -1.27,0; 4 1.27,0; 5 3.81,0; 6 6.35,0
SIL8 = drill 0.813 square: 1 -6.35,0 | drill 0.813: 2 -3.81,0; 3 -1.27,0; 4 1.27,0; 5 3.81,0; 6 6.35,0; 7 8.89,0; 8 11.43,0
3M_SD-RSMT-2-MQ = smd 1.2 x 1.7: 1 22.16,31.6; 2 19.66,31.6; 3 17.16,31.6; 4 14.66,31.6; 5 12.16,31.6; 6 9.66,31.6; 7 7.23,31.6; 8 5.53,31.6; 9 24.66,31.6 | smd 0.8 x 1.7: CARD-DETECT 4.23,31.6; WRITE-PROT 3.03,31.6 | smd 2 x 3.5: GND1 0.9,3.85; GND2 31.1,3.85 | hole 1.6: 24.78,28.8 | hole 1.1: 3.78,28.8
STM32F4-DISCOVERY = drill 0.8 square: P$1 -27.94,30.48; P$51 22.86,30.48 | drill 0.8: P$2 -25.4,30.48; P$3 -27.94,27.94; P$4 -25.4,27.94; P$5 -27.94,25.4; P$6 -25.4,25.4; P$7 -27.94,22.86; P$8 -25.4,22.86; P$9 -27.94,20.32; P$10 -25.4,20.32; P$11 -27.94,17.78; P$12 -25.4,17.78; P$13 -27.94,15.24; P$14 -25.4,15.24; P$15 -27.94,12.7; P$16 -25.4,12.7; P$17 -27.94,10.16; P$18 -25.4,10.16; P$19 -27.94,7.62; P$20 -25.4,7.62; P$21 -27.94,5.08; P$22 -25.4,5.08; P$23 -27.94,2.54; P$24 -25.4,2.54; P$25 -27.94,0; P$26 -25.4,0; P$27 -27.94,-2.54; P$28 -25.4,-2.54; P$29 -27.94,-5.08; P$30 -25.4,-5.08; P$31 -27.94,-7.62; P$32 -25.4,-7.62; P$33 -27.94,-10.16; P$34 -25.4,-10.16; P$35 -27.94,-12.7; P$36 -25.4,-12.7; P$37 -27.94,-15.24; P$38 -25.4,-15.24; P$39 -27.94,-17.78; P$40 -25.4,-17.78; P$41 -27.94,-20.32; P$42 -25.4,-20.32; P$43 -27.94,-22.86; P$44 -25.4,-22.86; P$45 -27.94,-25.4; P$46 -25.4,-25.4; P$47 -27.94,-27.94; P$48 -25.4,-27.94; P$49 -27.94,-30.48; P$50 -25.4,-30.48; P$52 25.4,30.48; P$53 22.86,27.94; P$54 25.4,27.94; P$55 22.86,25.4; P$56 25.4,25.4; P$57 22.86,22.86; P$58 25.4,22.86; P$59 22.86,20.32; P$60 25.4,20.32; P$61 22.86,17.78; P$62 25.4,17.78; P$63 22.86,15.24; P$64 25.4,15.24; P$65 22.86,12.7; P$66 25.4,12.7; P$67 22.86,10.16; P$68 25.4,10.16; P$69 22.86,7.62; P$70 25.4,7.62; P$71 22.86,5.08; P$72 25.4,5.08; P$73 22.86,2.54; P$74 25.4,2.54; P$75 22.86,0; P$76 25.4,0; P$77 22.86,-2.54; P$78 25.4,-2.54; P$79 22.86,-5.08; P$80 25.4,-5.08; P$81 22.86,-7.62; P$82 25.4,-7.62; P$83 22.86,-10.16; P$84 25.4,-10.16; P$85 22.86,-12.7; P$86 25.4,-12.7; P$87 22.86,-15.24; P$88 25.4,-15.24; P$89 22.86,-17.78; P$90 25.4,-17.78; P$91 22.86,-20.32; P$92 25.4,-20.32; P$93 22.86,-22.86; P$94 25.4,-22.86; P$95 22.86,-25.4; P$96 25.4,-25.4; P$97 22.86,-27.94; P$98 25.4,-27.94; P$99 22.86,-30.48; P$100 25.4,-30.48
TO92 = drill 0.813 octagon: 1 1.27,0; 2 0,1.905; 3 -1.27,0
KEYSTONE_SCREW_TERMINAL = drill 1.9 pad 3.2: P$1 0,0; P$2 7.5,0; P$3 0,5; P$4 7.5,5

### Placement (x,y rotation side)
C1  63.25,86.44 270 top
C2  93.83,65.22 0 top
C3  15,34 270 top
C4  41,34 180 top
C5  17.1,39.3 270 top
C6  51.1,39.4 0 top
C12  88.62,121.28 90 top
C13  95.77,117.46 270 top
CR_J2  101.3,110.1 90 top
D1  43.02,104.72 90 top
D2  70.1,13.8 0 top
D3  36.1,13.8 0 top
D4  53.2,13.7 0 top
D5  19,13.8 0 top
IC1  78.5,86.72 0 top
IC2  86.21,57.52 0 top
IC4  69.7,20 0 top
IC5  28.2,35.8 0 top
IC6  52.7,20 0 top
IC7  101.22,121.31 270 top
IC8  35.7,20 0 top
IC10  18.7,20 0 top
IC16  61.4,117.86 0 top
J1A  100.46,132.06 0 top
J1B  112.06,120.47 270 top
J4A  89.59,17.22 0 top
J4B  89.59,7.87 0 top
J5A  41.2,131.7 180 top
J5B  20.6,131.7 180 top
J8/9  82.4,131.7 180 top
J10A  28.5,108.2 180 top
J10B  112.04,72.65 90 top
J11E  55.71,32 0 top
J12  71.6,7.9 0 top
J13  56.2,7.9 0 top
J15_S  109.52,108.11 90 top
J15A  112.06,36.95 90 top
J15B  102.76,36.95 90 top
J16A  61.8,131.7 180 top
J16B  102.4,93.1 270 top
J18  44.27,111.27 180 top
J19  112.04,93.13 90 top
J20  40.8,7.9 0 top
J21  25.4,7.9 0 top
J30  87.25,108.27 180 top
LED1  2,22 90 top
LED2  2,16 90 top
OUTLINE  0,0 0 top
P1  113.53,18.64 180 top
P2  113.6,55.34 0 top
R1  77.66,121.38 90 top
R2  75.36,121.38 90 top
R3  80.03,121.29 90 top
R4  17.3,26.2 0 top
R5  10.5,40.3 180 top
R6  10.5,37.9 0 top
R7  43.6,38.5 0 top
R7A  84.11,30.93 90 top
R7B  101.17,8.15 90 top
R8  6.62,21.3 90 top
R8A  86.44,30.92 90 top
R8B  104.39,8.2 90 top
R11  81.78,30.92 90 top
R12  112.2,13.39 0 top
R13  102.73,17.99 270 top
R18  71.1,28.6 0 top
R19  66.8,26.2 180 top
R20  78.2,17.5 270 top
R21  63.4,17.5 90 top
R22  76,17.5 90 top
R23  46.6,25.9 0 top
R24  57.1,26.2 0 top
R25  61.2,17.5 270 top
R26  46.4,17.5 90 top
R27  59,17.5 90 top
R28  33.8,26.2 0 top
R29  31.4,28.3 180 top
R30  44.2,17.5 270 top
R31  29.4,17.6 90 top
R32  42,17.5 90 top
R33  82.59,65.46 0 top
R34  39.83,73.24 90 top
R35  16,28.4 180 top
R36  27.2,17.6 270 top
R37  12.8,11.5 180 top
R38  25,17.6 90 top
SD  2.1,90.16 270 top
STM32F4DISCOVERY  33.08,68.78 270 top
T1  106.7,20.06 0 top
U$1  -14.07,-14.02 0 top  (outside the outline)
U$2  -14.07,-22.66 0 top  (outside the outline)
U$6  [VLRLAB]  4.07,61.88 90 bottom
U$7  [VLRLAB]  4.29,120.41 0 top

### Tracks (layer width: path | path; a pad name or v marks a point on that pad's centre or on a via)
+3V3  (via drill 0.33)
  Top 0.406: 50.1,134.34 50.16,134.3 62.87,134.3 64.14,133.03 J16A.3 64.45,132.72 64.45,130.49 J16A.4 | 50.1,134.34 46.35,130.49 J5A.2 46.35,130.18 46.35,126.11 52.9,119.57 87.76,119.57 88.58,118.75 C12.+ 88.9,118.75 95.57,118.75 C13.1 95.89,118.75 100.97,118.75 IC7.OUT 101.28,118.75 107.95,112.08 110.17,112.08 111.12,111.12 111.12,107.25 109.54,105.73 J15_S.1 | 50.1,134.34 46.99,134.3 29.53,134.3 25.72,130.49 J5B.2 | v37.78,75.25 33.97,75.25 SD.4 | R34.1 40.01,66.99 58.05,66.99 58.93,67.87 73.98,67.91 110.58,67.91 110.49,67.31 J10B.2
  Bottom 0.406: J5B.2 25.72,130.18 34.92,120.97 34.92,108.27 33.66,107 J10A.2 | v37.78,75.25 37.78,68.9 39.69,66.99 R34.1 | J10B.2 110.49,67.63 109.22,68.9 109.22,105.41 J15_S.1
+5V  (via drill 0.33)
  Top 0.61: 84.92,127.79 84.98,127.85 84.98,130.07 J8/9.4 85.09,130.49 85.09,132.72 J8/9.3 | 84.92,127.79 80.85,123.72 55.78,123.72 53.98,121.92 IC16.14 | J19.4 110.81,90.81 113.03,90.81 J19.3 | CR_J2.2 101.6,111.12 101.92,110.81 109.22,110.81 J15_S.3 | 84.92,127.79 84.84,127.78 93.37,127.78 97.31,123.84 IC7.IN | P1.A 116.2,20.95 116.2,13.65 R12.2 115.89,13.34 114.3,11.75 104.46,11.75 R8B.2 104.14,12.06 101.28,12.06 R7B.2 | R8A.2 86.36,34.61 84.14,34.61 R7A.2 83.82,34.61 81.92,34.61 R11.2 81.6,34.61 77.15,30.16 68.58,30.16 67.31,28.89 R18.1 | C5.2 17.14,38.1 18.41,39.37 20.32,39.37 IC5.14 | 52.39,39.37 C6.2 | C1.1 63.5,87.95 66.04,90.49 66.99,90.49 IC1.20 | v69.85,95.66 100.65,95.66 100.97,95.57 J16B.3 | IC8.8 31.89,19.42 31.9,19.41
  Top 0.813: IC4.8 65.84,23.76 65.84,20.62 64.72,19.51 64.52,19.41 66.88,19.41 | 66.88,19.41 59.03,19.41 | 59.03,19.41 48.87,19.41 | 48.87,19.41 41.96,19.41 | 41.96,19.41 31.9,19.41 24.99,19.41 | 24.99,19.41 v13.41,19.41 | R38.2 24.99,19.41 | R32.2 42,25.11 R23.1 41.96,25.07 41.96,19.41 | IC6.8 48.87,23.79 48.87,19.41 | R27.2 59.03,21.28 59.03,19.41 | R22.2 74.1,19.41 66.88,19.41
  Bottom 0.406: IC8.8 31.89,24.3 R28.1
  Bottom 0.61: 102.39,125.25 105.41,128.27 105.41,131.76 J1A.1 | 102.39,125.25 101.28,124.14 IC7.IN | J16B.3 100.97,95.89 99.69,97.16 99.69,109.54 101.28,111.12 CR_J2.2 | J19.3 113.35,90.81 114.94,92.39 114.94,105.09 109.54,110.49 J15_S.3 109.54,110.81 109.54,113.03 111.76,115.25 J1B.1 111.76,115.57 111.76,115.89 102.39,125.25 | 113.03,26.35 110.17,26.35 109.22,27.3 108.51,27.94 104.14,27.94 J15B.1 | 113.03,26.35 113.03,27.94 J15A.1 | 113.03,26.35 113.03,24.13 115.89,21.27 P1.A | J4B.10 94.93,9.21 100.97,9.21 100.97,11.75 R7B.2 100.97,12.06 100.97,12.38 94.93,18.41 J4A.10 94.61,18.73 94.61,26.67 86.68,34.61 R8A.2 | LED2.A 2.22,14.92 2.19,14.89 3.49,16.19 3.49,19.37 2.22,20.64 LED1.A | 13.65,26.04 R4.1 | R4.1 13.65,26.35 16.83,29.53 16.83,37.78 C5.2 | 13.34,26.04 R4.1 | C6.2 52.07,39.37 50.8,38.1 50.8,33.34 J11E.2 50.48,33.02 48.9,31.43 IC6.8 | 65.09,41.73 72.03,41.76 74.91,38.81 74.93,38.79 74.93,32.7 69.06,26.83 | 65.09,41.73 62.52,41.73 61.07,43.38 STM32F4DISCOVERY.P$54 | 69.06,26.83 66.04,23.81 IC4.8 | 69.06,26.83 67.31,28.57 R18.1 | 65.09,41.73 65.09,86.04 63.5,87.63 C1.1 | v69.85,95.66 67.11,92.91 67.11,90.6 IC1.20
  Bottom 0.813: 13.39,23.77 13.39,19.38 v13.41,19.41 13.41,19.1 13.41,12.6 10.36,9.55 7.62,9.55 2.44,14.73 LED2.A | 13.39,23.77 13.41,25.7 13.41,26.2 R4.1 | IC10.8 14.75,23.77 13.39,23.77
+12V1
  Top 1.016: J1A.3 95.57,131.76 99.97,127.36 110.13,127.36 J1B.3
A0  (via drill 0.33)
  Top 0.254: v55.24,112.06 55.24,114.76 52.07,117.91 43.81,126.16 43.81,130.18 J5A.4
  Bottom 0.254: v55.24,112.06 55.24,97.47 55.88,96.84 STM32F4DISCOVERY.P$7
A1  (via drill 0.33)
  Top 0.254: v53.34,111.66 41.27,123.83 41.27,130.18 J5A.6
  Bottom 0.254: v53.34,111.66 54.61,110.49 54.61,95.25 53.66,94.3 STM32F4DISCOVERY.P$10
A2  (via drill 0.33)
  Top 0.254: v45.4,102.23 44.77,102.26 v38.73,102.26
  Bottom 0.254: v45.4,102.23 50.8,96.84 STM32F4DISCOVERY.P$11 | v38.73,102.26 38.73,130.18 J5A.8
A3  (via drill 0.33)
  Top 0.254: v36.83,97.47 36.83,96.52 37.78,95.57 44.45,95.57 45.72,94.3 STM32F4DISCOVERY.P$16
  Bottom 0.254: v36.83,97.47 36.8,97.6 36.8,129.67 J5A.10
A4  (via drill 0.33)
  Top 0.254: v26.35,93.03 39.69,93.03 40.64,93.98 STM32F4DISCOVERY.P$20
  Bottom 0.254: v26.35,93.03 25.08,93.03 24.13,93.98 24.13,94.61 23.18,95.57 22.23,95.57 22.23,95.89 21.59,96.52 21.59,128.91 22.86,130.18 J5B.4
A5  (via drill 0.33)
  Top 0.254: v39.69,111.12 20.64,130.18 J5B.6
  Bottom 0.254: v39.69,111.12 39.69,97.79 40.64,96.84 STM32F4DISCOVERY.P$19
A6  (via drill 0.33)
  Top 0.254: v19.68,95.57 36.83,95.57 38.1,94.3 STM32F4DISCOVERY.P$22
  Bottom 0.254: v19.68,95.57 19.05,96.2 19.05,129.22 18.1,130.18 J5B.8
A7
  Bottom 0.254: STM32F4DISCOVERY.P$21 38.1,96.84 37.78,97.16 37.78,129.54 37.47,129.86 37.47,130.81 36.51,131.76 16.78,131.76 15.56,130.49 J5B.10
AOUT_RC1  (via drill 0.33)
  Top 0.254: v16.51,50.1 21.65,55.24 v66.86,55.24 | J19.10 110.81,98.11 112.08,96.84 113.98,96.84 115.25,95.57 115.25,86.91 115.24,86.79 113.03,84.56 77.27,84.57 75.88,83.19 75.88,82.41 75.87,82.3 75.18,81.6 73.66,81.6 72.39,82.87 IC1.3
  Bottom 0.254: v16.51,50.1 16.51,44.45 15.56,43.5 STM32F4DISCOVERY.P$90 | v66.86,55.24 71.36,59.74 71.36,82.16 IC1.3 72.39,83.19 72.39,88.27 74.61,90.49 IC1.17
AOUT_RC2  (via drill 0.33)
  Top 0.254: v40.96,60.3 42.16,61.51 v67.27,61.51 | v76.86,99.38 112.08,99.38 113.03,98.42 J19.9
  Bottom 0.254: v40.96,60.3 40.96,46.04 STM32F4DISCOVERY.P$69 | v67.27,61.51 69.43,63.66 69.53,82.87 IC1.2 69.85,83.19 71.75,85.09 71.75,90.17 72.07,90.49 IC1.18 72.39,90.81 72.49,95.01 v76.86,99.38
AOUT_SC  (via drill 0.33)
  Top 0.254: J19.8 110.81,95.89 113.03,95.89 J19.7 113.35,95.57 114.62,94.3 114.62,87.14 114.61,87.12 112.55,85.09 76.85,85.1 74.93,83.19 IC1.4 | STM32F4DISCOVERY.P$78 31.8,44.64 31.8,46.33 32.92,47.45 45.92,47.45 46.94,46.43 46.94,46.33 46.94,45.52 47.69,44.77 v66.86,44.77
  Bottom 0.254: v66.86,44.77 72.92,50.93 73.03,81.28 74.61,82.87 IC1.4 74.93,83.19 74.93,88.27 77.15,90.49 IC1.16
AOUT_SI  (via drill 0.33)
  Top 0.254: v36.83,91.69 37.53,92.39 95.59,92.39 97.5,94.3 112.08,94.3 113.03,93.34 J19.5
  Bottom 0.254: v36.83,91.69 36.83,62.45 33.66,59.27 33.66,46.35 33.34,46.04 STM32F4DISCOVERY.P$75
AOUT_SO  (via drill 0.33)
  Top 0.254: v46.04,91.48 46.32,91.76 79.7,91.76 | 79.7,91.76 79.69,90.81 IC1.15 | 79.7,91.76 109.22,91.76 110.49,93.03 J19.6
  Bottom 0.254: v46.04,91.48 46.04,75.56 41.27,70.8 41.27,66.04 34.29,59.05 34.29,44.45 33.34,43.5 STM32F4DISCOVERY.P$76 | IC1.5 77.47,83.19 79.69,85.41 79.69,90.49 IC1.15
CAN_RX
  Top 0.254: 6.35,49.53 6.35,45.72 7.3,44.77 19.05,44.77 20.32,43.5 STM32F4DISCOVERY.P$86 | 6.35,49.53 3,49.53 1.27,47.7 1.22,47.65 1.27,27.84 2.22,26.89 3.17,26.05 3.17,22.73 7.47,18.44 80.06,18.39 80.02,18.39 81.6,19.86 81.6,26.99 R11.1 | J18.2 43.18,111.12 43.18,108.27 D1.A 42.86,107.95 39.37,104.46 14.85,104.46 8.94,98.55 8.94,52.12 6.35,49.53
CAN_TX  (via drill 0.33)
  Top 0.254: v13.97,100.7 14.39,100.89 42.41,100.89 42.96,100.94 D1.C
  Bottom 0.254: v13.97,100.7 13.97,58.28 22.86,49.39 STM32F4DISCOVERY.P$83
CR_M1-
  Top 0.254: IC4.3 71.12,15.88 73.03,13.97 73.66,13.97 D2.A
  Bottom 0.254: J12.1 69.22,6.67 70.48,7.94 70.48,10.48 73.66,13.65 D2.A
CR_M2+$1
  Top 0.254: D2.C 66.36,13.97 68.26,15.88 IC4.2
  Bottom 0.254: R20.1 78.11,21.27 74.3,17.46 69.8,17.46 68.58,16.19 IC4.2
D0
  Bottom 0.254: STM32F4DISCOVERY.P$26 33.34,94.3 34.29,95.25 34.29,98.65 34.29,103.89 32.31,105.87 32.31,108.2 J10A.3
D1
  Bottom 0.254: STM32F4DISCOVERY.P$27 30.8,96.84 30.8,106.68 J10A.4
D2
  Bottom 0.254: STM32F4DISCOVERY.P$28 30.48,94.3 29.21,95.57 29.21,106.05 29.84,106.68 29.84,107.95 28.57,109.22 J10A.5
D3
  Bottom 0.254: STM32F4DISCOVERY.P$29 28.26,96.84 28.26,106.68 J10A.6
D4
  Bottom 0.254: STM32F4DISCOVERY.P$30 27.94,94.3 26.67,95.57 26.67,106.05 27.3,106.68 27.3,107.95 26.04,109.22 J10A.7
D5
  Bottom 0.254: STM32F4DISCOVERY.P$31 25.72,96.84 25.72,106.68 J10A.8
D6
  Bottom 0.254: STM32F4DISCOVERY.P$32 25.4,94.3 24.13,95.57 24.13,106.05 24.77,106.68 24.77,107.95 23.5,109.22 J10A.9
D7
  Bottom 0.254: STM32F4DISCOVERY.P$33 23.18,96.84 23.18,106.68 J10A.10
D8  (via drill 0.33)
  Top 0.254: v56.52,68.9 112.08,68.9 113.03,69.85 J10B.3 113.35,70.17 115.89,72.71 115.89,97.47 113.35,100.01 93.98,100.01 87.31,106.68 J30.6
  Bottom 0.254: v56.52,68.9 52.07,64.45 52.07,44.45 51.12,43.5 STM32F4DISCOVERY.P$62
D9  (via drill 0.33)
  Top 0.254: v58.74,69.85 v88.58,69.85 110.49,69.85 J10B.4
  Bottom 0.254: v58.74,69.85 53.98,65.09 53.98,46.35 53.66,46.04 STM32F4DISCOVERY.P$59 | v88.58,69.85 88.58,102.87 84.77,106.68 J30.8
D10  (via drill 0.33)
  Top 0.254: v69.85,98.74 77.79,106.68 81.92,106.68 J30.10 | v62.23,71.44 112.08,71.44 113.03,72.39 J10B.5
  Bottom 0.254: 61.91,71.75 54.61,64.45 54.61,44.45 53.66,43.5 STM32F4DISCOVERY.P$60 | 61.91,71.75 61.91,90.81 v69.85,98.74 | 61.91,71.75 v62.23,71.44
D11  (via drill 0.33)
  Top 0.254: v46.04,68.77 49.66,72.39 110.49,72.39 J10B.6
  Bottom 0.254: v46.04,68.77 46.04,46.04 STM32F4DISCOVERY.P$65
D12  (via drill 0.33)
  Top 0.254: v103.5,47.62 50.18,47.62 49.54,46.99 49.53,46.99 48.58,46.04 STM32F4DISCOVERY.P$63
  Bottom 0.254: v103.5,47.62 107.95,52.07 107.95,62.87 112.08,66.99 112.08,73.98 113.03,74.93 J10B.7
D13  (via drill 0.33)
  Top 0.254: v46.99,71.91 48.64,73.56 109.22,73.66 110.49,74.93 J10B.8
  Bottom 0.254: v46.99,71.91 46.99,44.77 48.26,43.5 STM32F4DISCOVERY.P$64
D14  (via drill 0.33)
  Top 0.254: v61.06,75.35 62.23,76.52 112.08,76.52 113.03,77.47 J10B.9
  Bottom 0.254: v61.06,75.35 51.44,65.72 51.44,46.35 51.12,46.04 STM32F4DISCOVERY.P$61
D15  (via drill 0.33)
  Top 0.254: v35.88,76.52 36.2,76.2 38.54,76.2 38.86,75.88 52.09,75.88 53.68,77.47 110.49,77.47 J10B.10
  Bottom 0.254: v35.88,76.52 35.88,89.27 31.75,93.4 31.75,95.25 33.02,96.52 STM32F4DISCOVERY.P$25
DIN_RC2
  Top 0.254: STM32F4DISCOVERY.P$42 13.02,93.98 17.58,89.42 56.11,89.42 65.18,80.35 65.25,80.35 65.13,80.33 77.15,80.33 79.69,82.87 IC1.6
DIN_SI
  Bottom 0.254: STM32F4DISCOVERY.P$38 17.78,94.3 16.51,95.57 16.51,127.64 14.29,129.86 14.29,133.35 15.88,134.94 80.3,134.94 82.23,133.03 J8/9.5
DINOUT_SC  (via drill 0.33)
  Top 0.254: v18,102.45 19.37,103.82 42.55,103.82 48.9,110.17 60.96,110.17 67.68,103.35 67.68,94.97 68.83,93.85 v85.31,93.85
  Bottom 0.254: v18,102.45 18,96.84 STM32F4DISCOVERY.P$37 | v85.31,93.85 86.04,92.71 86.04,84.14 85.09,83.19 IC1.8
DOUT_RC1  (via drill 0.33)
  Top 0.254: v82.12,86.56 82.12,86.49 81.99,86.36 75.69,86.36 75.39,86.36 62.87,86.36 58.61,90.61 24,90.61 20.64,93.98 STM32F4DISCOVERY.P$36
  Bottom 0.254: v82.12,86.56 82.23,86.04 82.23,83.19 IC1.7
DOUT_SO
  Top 0.254: STM32F4DISCOVERY.P$39 15.56,96.52 16.83,95.25 18.41,95.25 19.05,94.61 19.05,93.78 19.05,93.73 19.91,92.86 20.8,92.86 23.69,89.98 56.71,89.98 65.82,80.86 76.83,80.86 78.42,82.45 78.44,83.31 79.15,84.02 79.34,84.04 86.46,84.04 87.31,83.19 IC1.9
GND  (via drill 0.33)  (115 unrouted)
  other vias: 78.64,79.65 73.66,84.94 93.57,93.88 93.68,89.81 93.57,79.65 85.95,79.55 54.05,83.11 68.28,84.84 51.82,69.6 61.67,59.54 61.77,50.09 50.5,49.99 38.81,61.06 37.49,50.29 14.12,49.78 43.59,31.6
  pour Bottom: -15.6,149.9 125.2,149.9 125.2,-6.7 -15.7,-6.7 -15.7,149.9
  pour Top: -15.4,149.8 125.4,149.8 125.4,-6.8 -15.5,-6.8 -15.5,149.8
IIC0_SC  (via drill 0.33)
  Top 0.254: v35.65,64.16 36.64,63.17 v75.65,63.17
  Bottom 0.254: v35.65,64.16 24.66,75.15 24.66,92.49 23.18,93.98 STM32F4DISCOVERY.P$34 | J4A.8 92.08,18.73 86.68,24.13 86.68,26.99 R8A.1 86.36,27.3 80.33,33.34 80.33,50.8 80.33,51.54 81.1,52.31 81.1,54.56 75.84,59.82 75.84,62.78 v75.65,63.17
IIC0_SD  (via drill 0.33)
  Top 0.254: v21.59,67.27 31.48,57.38 76.1,57.4 v76.36,57.67 v76.36,57.68
  Bottom 0.254: v21.59,67.27 21.59,95.57 20.64,96.52 STM32F4DISCOVERY.P$35 | J4A.6 89.53,18.73 84.14,24.13 84.14,26.99 R7A.1 83.82,27.3 78.63,32.49 78.63,55.42 v76.36,57.68
IIC1_SC  (via drill 0.33)  (1 unrouted)
  Top 0.254: R8B.1 104.14,4.45 98.11,10.48 93.66,10.48 92.39,9.21 J4B.8 | 35.88,45.72 37.1,44.5 46.23,44.5 46.94,43.79 46.94,42.77 47.55,42.16 56.79,42.16 57.17,42.55 v57.25,42.44
  Bottom 0.254: v57.25,42.44 64.45,35.24 64.45,19.37 67.31,16.51 67.31,15.56 67.94,14.92 83.82,14.92 87,11.75 89.53,11.75 92.08,9.21 J4B.8
IIC1_SD
  Bottom 0.254: 88.27,5.4 37.78,5.4 33.34,9.84 33.34,17.14 38.1,21.91 38.1,24.13 40.96,26.99 40.96,43.18 STM32F4DISCOVERY.P$70 | 88.27,5.4 88.27,7.62 89.53,8.89 J4B.6 | 88.27,5.4 89.18,4.45 100.97,4.45 R7B.1
J8/9-RC1
  Bottom 0.254: R2.2 75.56,125.41 77.15,127 77.15,130.18 J8/9.10
J8/9-RC2
  Bottom 0.254: R1.2 77.79,125.41 78.42,126.05 78.42,131.76 77.47,132.72 J8/9.9
J8/9-SC
  Top 0.254: R3.2 80.01,125.41 80.01,130.18 J8/9.8 80.01,130.49 80.01,132.72 J8/9.7
J8/9-SO
  Bottom 0.254: IC1.11 89.85,90.81 89.22,91.44 89.22,103.19 86.04,106.36 86.04,107.31 85.09,108.27 84.14,108.27 83.5,108.9 83.5,127.14 82.35,128.29 82.35,130.38 J8/9.6
LCD_D7  (via drill 0.33)
  Top 0.254: v31.75,41.27 32.07,41.59 45.72,41.59 46.35,40.96 72.07,40.96 75.88,44.77 76.33,45.21 v92.56,45.21 | J15A.4 110.49,30.8 110.17,31.11 105.09,31.11 104.46,31.75 103.5,31.75 102.55,30.8 101.6,30.8 J15B.4
  Bottom 0.254: v31.75,41.27 31.75,44.77 30.8,45.72 STM32F4DISCOVERY.P$77 | 101.28,30.8 J15B.4 92.56,39.52 v92.56,45.21 IC2.7
LCD_E1  (via drill 0.33)
  Top 0.254: 76.83,56.83 76.71,56.83 | 76.71,56.83 16.68,56.83 7.73,47.87 STM32F4DISCOVERY.P$95 | 76.71,56.83 77.15,56.83 v78.64,58.32 v92.76,58.32
  Bottom 0.254: J15A.12 109.45,39.42 101.09,39.42 96.32,44.2 96.32,54.56 92.96,57.91 v92.76,58.32 | R33.2 78.64,65.32 v78.64,58.32
LCD_E2  (via drill 0.33)
  Top 0.254: v8.89,46.67 18.41,56.2 77.53,56.3 78.74,57.51 v94.89,57.51
  Bottom 0.254: v8.89,46.67 8.89,44.45 7.94,43.5 STM32F4DISCOVERY.P$96 | J15B.12 101.28,40.96 96.94,45.2 96.94,49.64 96.93,49.76 96.83,55.58 v94.89,57.51 92.86,59.54 92.35,59.54 91.24,60.66 91.24,63.2 90.63,63.8 | J30.7 84.77,109.54 86.04,110.81 90.46,110.81 91.14,110.13 91.14,64.31 90.63,63.8 | 90.63,63.8 90.22,64.21 87.07,64.21 86.4,64.88 R33.5
LCD_RS  (via drill 0.33)
  Top 0.254: J15A.14 110.49,43.18 109.22,41.91 102.87,41.91 101.6,43.18 J15B.14 101.28,43.5 84.34,43.5 v84.12,43.48 | STM32F4DISCOVERY.P$93 10.48,46.04 12.57,48.13 72.06,48.13 74.97,48.13 83.08,48.13 v83.62,48.46 | v81.6,110.81 85.72,110.81 87,109.54 J30.5
  Bottom 0.254: v81.6,110.81 80.96,110.17 80.96,68.36 R33.4 83.86,62.79 IC2.14 82.4,57.61 83.62,56.39 83.62,54.36 v83.62,48.46 83.62,43.99 v84.12,43.48
LCD_RW  (via drill 0.33)
  Top 0.254: J15B.11 104.14,40.96 104.46,41.27 109.54,41.27 110.17,41.91 112.08,41.91 113.03,40.96 J15A.11 | v19.05,50 21.12,52.07 73.83,52.07 73.83,52.08 76.81,55.07 84.23,55.07 v85.04,55.88 | R33.6 90.6,63.8 95.81,63.8 99.77,59.84 | 99.77,59.84 v99.77,53.95 | IC2.13 86.43,59.84 99.77,59.84
  Bottom 0.254: v19.05,50 19.05,45.4 18.41,44.77 18.41,43.81 18.1,43.5 STM32F4DISCOVERY.P$88 | J30.9 82.23,109.22 83.5,107.95 83.5,70.9 R33.6 | 104.14,40.96 J15B.11 104.03,40.85 104.39,41.2 104.5,41.2 105.36,42.06 105.36,43.79 104.65,44.5 100.58,44.5 99.77,45.31 v99.77,53.95 | v85.04,55.88 85.04,61.23 IC2.13
LCD_SER_RCLK  (via drill 0.33)
  Top 0.254: v32.5,54.34 33.97,54.29 73.98,54.29 75.45,55.77 78.42,55.77 79.35,56.69 v86.87,56.69
  Bottom 0.254: v32.5,54.34 25.51,47.36 STM32F4DISCOVERY.P$81 | v86.87,56.69 87.48,57.31 IC2.12
LCD_SER_SCLK  (via drill 0.33)
  Top 0.254: STM32F4DISCOVERY.P$80 28.26,43.18 29.21,42.23 46.04,42.23 46.67,41.59 71.65,41.59 75.78,45.72 76.09,46.02 v88.49,46.02
  Bottom 0.254: v88.49,46.02 88.8,46.33 88.8,58.52 90.02,59.75 IC2.11
LCD_VOLTAGE_OPTION  (via drill 0.33)
  Top 0.61: J15_S.2 109.22,107.95 106.68,105.41 91.12,105.41 89.85,106.68 J30.4 | 101.28,46.04 J15B.16 | IC2.16 78.88,62.89 91.03,62.89 92.56,61.36 IC2.10 | P2.A 106.12,52.8 v106.11,52.81
  Bottom 0.61: J30.4 89.85,107 89.85,109.22 J30.3 | v106.11,52.81 105.19,51.82 101.5,48.12 101.5,46.04 J15B.16 | v106.11,52.81 106.21,52.83 | 106.21,52.83 106.21,62.79 | 106.21,62.79 106.21,104.94 109.22,107.95 J15_S.2 | R33.1 77.32,64.38 IC2.16 | C2.1 92.56,65.02 IC2.10 94.02,62.79 106.21,62.79 | v106.11,52.81 106.21,52.83 | P2.A 110.79,52.52 J15A.16
MF_M+ZULEITUNG
  Top 0.254: R25.2 60.96,13.65 60.96,8.5 59.05,6.67 J13.5
MF_M+ZULEITUNG1
  Top 0.254: R30.2 44.45,13.65 44.45,7.58 43.5,6.67 J20.5
MF_M+ZULEITUNG2
  Bottom 0.254: R36.2 27.3,13.65 29.21,11.75 29.21,7.94 27.94,6.67 J21.5
MF_M-ZULEITUNG
  Top 0.254: D4.A 56.83,13.97 54.93,15.88 53.98,15.88 IC6.3
  Bottom 0.254: J13.1 53.98,6.67 54.93,7.62 54.93,11.75 56.83,13.65 D4.A
MF_M-ZULEITUNG1
  Top 0.254: D3.A 39.69,13.97 37.78,15.88 37.15,15.88 IC8.3
  Bottom 0.254: J20.1 38.42,6.67 39.69,7.94 39.69,13.65 D3.A
MF_M-ZULEITUNG2
  Top 0.254: D5.A 22.54,13.97 20.64,15.88 20,15.88 IC10.3
  Bottom 0.254: J21.1 22.86,6.67 20,9.53 20,15.88 IC10.3
MI1  (via drill 0.33)
  Top 0.254: v45.4,34.29 45.72,34.61 51.75,34.61 53.02,33.34 J11E.4 53.34,33.02 54.36,32 56.08,32 57,31.09 57,30.18 57.65,29.53 62.74,29.53 65.67,26.49 68.02,26.49 70.8,23.81 IC4.6 | v41.91,40.74 41.59,40.96 35.12,40.96 34.61,40.4 34.62,40.39 34.61,39.27 33.76,38.42 30.06,38.42 29.46,38.91 29.46,39.97 29.43,40.11 28.57,40.96 24.45,40.96 23.18,39.69 IC5.13
  Bottom 0.254: IC4.6 71.12,23.81 74.61,27.3 74.61,28.57 R18.2 | v45.4,34.29 41.91,37.78 v41.91,40.74 42.01,70.23 47.09,75.31 46.99,95.25 48.26,96.52 STM32F4DISCOVERY.P$13
MI2  (via drill 0.33)
  Top 0.254: IC6.6 53.66,23.81 51.75,25.72 50.48,25.72 R23.2 | v11.43,29.53 12.06,30.16 48.82,30.16 49.45,29.53 52.07,29.53 53.02,30.48 J11E.3
  Bottom 0.254: v11.43,29.53 11.43,95.25 12.7,96.52 STM32F4DISCOVERY.P$41 | R23.2 50.48,26.04 53.02,28.57 53.02,30.48 J11E.3
MI3  (via drill 0.33)
  Top 0.254: v37.47,34.92 37.78,35.24 53.66,35.24 55.56,33.34 J11E.6
  Bottom 0.254: STM32F4DISCOVERY.P$74 35.88,43.18 37.47,41.59 v37.47,34.92 37.47,26.35 R28.2 37.47,26.04 37.47,24.13 37.15,23.81 IC8.6
MI4
  Top 0.254: J11E.5 55.56,30.48 54.08,28.99 48.79,28.99 48.16,29.63 24.55,29.63 21.27,26.35 R4.2
  Bottom 0.254: STM32F4DISCOVERY.P$84 22.86,43.18 21.91,42.23 21.91,26.99 21.27,26.35 R4.2 20.95,26.04 20.95,24.77 20,23.81 IC10.6
MO1  (via drill 0.33)
  Top 0.254: v20.95,36.2 21.27,36.51 57.15,36.51 58.1,35.56 58.1,33.34 J11E.8
  Bottom 0.254: STM32F4DISCOVERY.P$14 48.58,93.98 49.53,93.03 49.53,43.18 52.07,40.64 58.1,40.64 58.1,33.34 J11E.8 58.42,33.02 59.37,32.07 59.37,30.16 59.05,29.84 59.05,25.72 63.18,21.59 R21.2 | v20.95,36.2 20.95,32.38 20.64,32.07 IC5.1
MO2  (via drill 0.33)
  Top 0.254: v19.32,74.98 35.56,58.84 v42.86,58.84
  Bottom 0.254: v19.32,74.98 19.32,90.22 15.56,93.98 STM32F4DISCOVERY.P$40 | v42.86,58.84 44.45,57.15 44.45,38.73 46.35,36.83 46.35,22.54 | 46.35,22.54 46.35,21.59 R26.2 | 46.35,22.54 51.75,22.54 52.7,23.5 52.7,24.13 54.61,26.04 54.61,26.99 58.1,30.48 J11E.7
MO3  (via drill 0.33)
  Top 0.254: 28.57,22.23 29.21,21.59 R31.2 | 28.57,22.23 27.94,22.86 24.45,22.86 24.13,22.54 6.55,22.54 6.5,22.59 5.18,23.88 5.18,41.55 3.81,42.93 3.81,44.45 5.08,45.72 STM32F4DISCOVERY.P$97 | v60.01,27.94 59.58,27.81 37.6,27.81 34.87,25.08 31.43,25.08 28.57,22.23
  Bottom 0.254: v60.01,27.94 61.91,29.84 61.91,32.07 60.96,33.02 J11E.10
MO4  (via drill 0.33)
  Top 0.254: v12.38,33.97 23.81,33.97 25.72,35.88 54.8,35.88 56.83,34.07 56.82,34.06 56.83,33.02 57.78,32.07 59.37,32.07 60.64,30.8 J11E.9
  Bottom 0.254: STM32F4DISCOVERY.P$85 20.32,45.72 19.05,44.45 19.05,42.86 18.1,41.91 12.38,41.91 v12.38,33.97 12.38,29.84 13.34,28.89 13.34,27.94 9.21,23.81 9.21,11.75 R37.2
N$1
  Top 0.254: J15A.3 113.03,30.48 111.76,29.21 105.41,29.21 104.14,30.48 J15B.3
  Bottom 0.254: IC2.6 90.02,38 98.65,29.36 102.82,29.36 104.03,30.57 J15B.3
N$2  (via drill 0.33)
  Top 0.254: J15A.6 110.49,33.34 110.17,33.66 105.09,33.66 104.46,34.29 102.55,34.29 101.6,33.34 J15B.6 92.95,33.14 v87.48,38.61
  Bottom 0.254: IC2.5 v87.48,38.61
N$3  (via drill 0.33)
  Top 0.254: J15A.5 113.03,33.02 111.76,31.75 105.41,31.75 104.14,33.02 J15B.5 103.34,33.14 102.11,31.9 92.25,31.9 v85.04,39.12
  Bottom 0.254: IC2.4 85.04,53.61 v85.04,39.12
N$4  (via drill 0.33)
  Top 0.254: J15A.8 110.49,35.88 110.17,36.2 105.09,36.2 104.46,36.83 102.55,36.83 101.6,35.88 J15B.8 92.14,35.68 87.58,40.23 82.7,40.23 v82.4,40.54
  Bottom 0.254: IC2.3 v82.4,40.54
N$5
  Top 0.254: SD.9 33.66,65.72 36.2,65.72 37.26,66.78 39.69,69.22 R34.2
N$6  (via drill 0.33)
  Top 0.254: v70.8,88.27 71.03,88.04 100.24,88.04 100.97,87.95 J16B.9
  Bottom 0.254: v70.8,88.27 70.8,107.31 64.14,113.98 IC16.5
N$7
  Top 0.254: SD.8 33.97,84.45 34.29,84.14 37.78,84.14 39.69,82.23 R34.7
N$8  (via drill 0.33)
  Top 0.254: J15A.7 113.03,35.56 111.76,34.29 105.41,34.29 104.14,35.56 J15B.7 | v94.18,50.7 93.67,51.1 81.08,51.1 79.86,52.32 IC2.2
  Bottom 0.254: J15B.7 102.83,36.88 100.38,36.88 94.18,43.08 v94.18,50.7
N$9  (via drill 0.33)
  Top 0.254: J15A.10 110.49,38.42 109.54,39.37 102.55,39.37 101.6,38.42 J15B.10 | IC2.1 81.05,49.89 v95.3,49.89
  Bottom 0.254: v95.3,49.89 95.61,49.48 95.61,43.18 100.57,38.22 J15B.10
N$10
  Top 0.254: 98.23,49.09 111.89,49.09 114.62,46.35 114.62,39.64 113.35,38.42 J15A.9 113.03,38.1 111.76,36.83 105.41,36.83 104.14,38.1 J15B.9 | 98.23,49.09 98.22,49.09 98.23,49.09 | IC2.15 82.06,59.13 94.59,59.13 97.84,56.08 97.84,49.48 98.23,49.09
N$11
  Bottom 0.254: IC4.7 68.58,23.81 70.48,25.72 70.48,26.04 R19.1
N$12
  Top 0.254: J15B.13 104.14,43.5 105.09,44.45 112.08,44.45 113.03,43.5 J15A.13
  Bottom 0.254: P2.S 113.67,57.78 114.62,56.83 114.62,44.77 113.35,43.5 J15A.13
N$13
  Top 0.254: IC16.3 59.05,114.3 60.01,115.25 65.41,115.25 66.36,114.3 IC16.6
N$14
  Top 0.254: R13.2 102.87,14.29 104.46,15.88 113.35,15.88 P1.S
N$15
  Top 0.254: R13.1 102.87,21.91 106.68,21.91 T1.2
N$16
  Bottom 0.254: R22.1 75.88,13.65 74.3,12.06 74.3,9.21 J12.6
N$18
  Top 0.254: J15A.2 110.49,27.94 109.22,26.67 102.87,26.67 101.6,27.94 J15B.2
  Bottom 0.254: R12.1 108.27,13.65 105.73,16.19 105.73,20 T1.3 105.41,20.32 105.41,24.13 101.6,27.94 J15B.2
N$19
  Bottom 0.254: D4.C 49.53,13.97 51.12,15.56 51.12,15.88 IC6.2 52.76,17.46 57.15,17.46 60.96,21.27 R25.1
N$20
  Top 0.254: R20.2 78.11,13.65 78.11,10.43 74.3,6.67 J12.5
N$21
  Top 0.254: IC5.9 33.02,39.69 30.8,39.69 IC5.10 30.68,39.89 28.96,41.59 17.78,41.59 17.46,41.91 16.19,41.91 14.61,40.32 R5.1
  Bottom 0.254: R5.1 14.29,40.01 13.02,38.73 13.02,34.92 14.92,33.02 C3.-
N$22  (via drill 0.33)
  Top 0.254: v23.81,35.24 15.24,35.24 C3.+
  Bottom 0.254: v23.81,35.24 27.94,39.37 IC5.11
N$23
  Top 0.254: 19.44,37.78 21.3,37.81 23.84,37.81 25.4,39.37 IC5.12 | 19.44,37.78 18.49,36.83 16.37,36.83 15.32,37.88 R6.2 | 19.44,37.78 33.97,37.78 35.56,39.37 IC5.8
N$25
  Top 0.254: R27.1 59.05,13.65 59.05,9.21 J13.6
N$26
  Top 0.254: R26.1 46.67,13.65 51.12,9.21 53.66,9.21 J13.2
N$27
  Bottom 0.254: LED1.K 2.22,23.5 4.71,25.98 4.71,35.83 6.67,37.78 R6.1
N$28
  Top 0.254: D3.C 32.38,13.97 34.29,15.88 IC8.2
  Bottom 0.254: R30.1 44.13,21.27 40.32,17.46 35.83,17.46 34.61,16.19 IC8.2
N$29
  Bottom 0.254: IC8.7 34.61,23.81 34.92,24.13 34.92,28.26 R29.1
N$30
  Bottom 0.254: R32.1 42.23,13.65 43.18,12.7 43.18,9.21 J20.6
N$31
  Top 0.254: R31.1 29.53,13.65 33.97,9.21 38.1,9.21 J20.2
N$32
  Top 0.254: D5.C 15.24,13.97 17.14,15.88 IC10.2
  Bottom 0.254: R36.1 26.99,21.27 23.18,17.46 18.58,17.46 17.46,16.19 IC10.2
N$33
  Bottom 0.254: IC10.7 17.46,23.81 19.68,26.04 19.68,28.26 R35.1
N$34
  Bottom 0.254: R38.1 25.08,13.65 27.94,10.79 27.94,9.21 J21.6
N$35
  Top 0.254: R37.1 16.83,11.43 19.05,9.21 22.86,9.21 J21.2
N$36
  Top 0.254: IC5.4 28.26,32.07 30.48,32.07 IC5.5
N$37
  Bottom 0.254: R7.1 40.01,38.42 40.01,34.29 C4.-
N$39
  Top 0.254: IC5.3 25.72,32.07 26.99,33.34 38.42,33.34 39.05,32.7 40.96,32.7 42.23,33.97 C4.+
N$40
  Top 0.254: R8.2 6.63,26 11.43,30.8 21.91,30.8 22.86,31.75 IC5.2
  Bottom 0.254: IC5.6 33.02,32.07 31.75,33.34 23.18,33.34 23.18,32.07 IC5.2
N$42
  Top 0.254: R8.1 5.4,17.46 2.22,17.46 LED2.K
N$81
  Top 0.254: R21.1 63.5,13.65 67.94,9.21 68.9,9.21 J12.2
N$99
  Bottom 0.254: IC6.7 53.02,25.4 53.02,26.04 R24.1
RC-I-  (via drill 0.33)
  Top 0.254: v78.51,89.5 78.65,89.5 78.74,89.41 81.22,89.39 82.23,90.49 IC1.14
  Bottom 0.254: v78.51,89.5 78.42,89.53 78.42,114.62 75.56,117.47 R2.1
RC-O-  (via drill 0.33)
  Top 0.254: v84.45,105.41 83.5,106.36 83.5,107.61 82.91,108.2 81.66,108.2 81.6,108.27 77.79,112.08 77.79,117.47 R1.1
  Bottom 0.254: v84.45,105.41 84.45,91.12 84.77,90.81 IC1.13
SC-  (via drill 0.33)
  Top 0.254: v86.68,103.5 86.68,105.73 86.04,106.36 86.06,106.38 86.06,107.7 86.61,108.25 90.47,108.25 91.14,108.92 91.14,110.44 87.58,114 81.99,114 80.03,115.96 R3.1
  Bottom 0.254: v86.68,103.5 86.68,91.44 87.31,90.81 IC1.12
SPI_RC1
  Top 0.254: SD.1 33.72,68.01 35.45,68.01 37.2,69.76 37.2,71.04 38.12,71.96 R34.3
  Bottom 0.254: J16A.10 56.52,130.18 55.24,128.91 55.24,115.57 53.98,114.3 IC16.1 53.66,113.98 44.09,114 44.08,113.98 41.91,111.85 41.91,96.2 40.96,95.25 35.88,95.25 35.88,94.3 STM32F4DISCOVERY.P$24 35.88,93.98 40.96,88.9 40.96,73.03 40.01,72.07 R34.3
SPI_RC2  (via drill 0.33)
  Top 0.254: v59.63,108.2 50.56,99.14 12.78,99.14 10.48,96.84 STM32F4DISCOVERY.P$43
  Bottom 0.254: v59.63,108.2 61.28,109.86 61.28,113.98 IC16.4 61.59,114.3 62.55,115.25 62.55,121.92 65.72,125.09 65.72,134.3 | 65.72,134.3 58.1,134.3 56.83,133.03 J16A.9 | 65.72,134.3 77.79,134.3 78.63,133.46 78.63,132.41 79.06,131.98 79.26,131.76 82.87,131.76 83.5,131.13 83.52,129.84 83.5,129.83 84.42,128.91 87.31,128.91 102.55,113.67 102.55,94.3 103.5,93.34 J16B.6
SPI_SC  (via drill 0.33)
  Top 0.254: J16A.7 59.37,132.72 59.37,130.49 J16A.8 59.37,130.18 62.32,127.23 64.24,127.23 66.29,127.23 v67.18,126.31 | SD.5 33.97,77.79 34.29,77.47 39.37,77.47 39.69,77.15 R34.5 40.01,77.15 43.81,77.15 v44.45,77.79 44.77,78.11 88.58,78.11 v93.29,82.82
  Bottom 0.254: v44.45,77.79 44.45,95.25 45.72,96.52 STM32F4DISCOVERY.P$15 46.04,96.84 46.04,97.79 48.9,97.79 49.53,97.16 49.53,93.98 50.16,93.34 50.16,93.03 56.52,93.03 57.15,93.66 57.15,97.16 62.55,102.55 62.55,114.3 65.09,116.84 65.09,122.49 65.13,122.53 67.18,124.59 v67.18,126.31 | v93.29,82.82 100.97,90.49 J16B.7
SPI_SI  (via drill 0.33)
  Top 0.254: SD.7 35.19,82.92 38.52,79.59 39.79,79.59 R34.6 40.01,79.69 v43.5,83.19
  Bottom 0.254: J16A.5 61.59,132.72 60.64,131.76 60.64,125.09 57.47,121.92 57.47,115.25 56.52,114.3 IC16.2 56.2,113.98 55.18,112.92 51.64,112.92 44.45,105.73 44.45,96.2 43.81,95.57 43.81,94.61 43.5,94.3 STM32F4DISCOVERY.P$18 43.5,93.98 v43.5,83.19
SPI_SO  (via drill 0.33)
  Top 0.254: SD.2 34.84,70.5 38.84,74.5 39.79,74.5 R34.4 94.26,74.5 94.36,74.5 v95.53,75.67 | v57.31,103.5 51.6,97.79 44.45,97.79 43.5,96.84 STM32F4DISCOVERY.P$17
  Bottom 0.254: STM32F4DISCOVERY.P$17 43.18,96.52 41.91,95.25 41.91,72.39 40.32,70.8 38.73,70.8 38.73,73.34 39.69,74.3 R34.4 | v95.53,75.67 95.53,79.97 103.5,87.95 J16B.10 | v57.31,103.5 57.31,107.16 60.01,109.86 60.01,121.92 61.28,123.19 61.28,129.86 61.59,130.18 J16A.6

### Text on the board
tNames: 12V | GND | 5V | 3V3 | SPI or SD | 12V | GND | Midibox Core STM32F407 PCB / (C) T.Klose / I.Hörler / B.Bouchez / Version 2.2.1 / RTP Ready | 5V | 5V | 3V3 | MIDI 1 TEST
bNames: 12V | GND | 5V | GND | GND | RC2 | SC | SI | 5V | GND | RC2 | SC | SI | 5V | GND | 1 | 1 | 1 | 1 | ANALOG | ANALOG | SPI | DIN/DOUT | A7 | A6 | A5 | A4 | 3V3 | A3 | A2 | A1 | A0 | 3V3 | RC1 | SC | SO | 5V | GND | RC1 | SC | SO | 5V | GND | 12V | 5V | C12 | GND | 3.3V | C13 | 5V | D1 | D0 | DC | CR_J2 | D6 | D4 | D2 | D0 | GND | 5V | 1 | 5V | DIGITAL A | 1 | DISP-EXT | GND | D7 | D5 | D3 | D1 | 3V3 | RC | GND | 3.3V | SDA | SC | LCD-VD | 1 | RC2 | RC1 | SC | SC | KISSBOX OEM RTP-MIDI | SO | SI | AOUT / SPI | 3V3 | 3V3 | GND | GND | 1 | D15 | D14 | D13 | D12 | D11 | D10 | DIGITAL B | D9 | D8 | 3V3 | GND | 1 | LCD-VD | LCD-VD | GND | GND | RS | V0 | RS | V0 | IC5 | E | RW | E | RW | D1 | D0 | D1 | D0 | MI1 | MI3 | MO1 | MO3 | D3 | D2 | D3 | D2 | 5V | D5 | D4 | D5 | D4 | D7 | D6 | D7 | D6 | MI2 | MI4 | 5V | GND | MO2 | MO4 | Lum | 5V | Lum | 1 | 1 | MI4 | MI3 | MI2 | MI1 | SD | SC | 5V | M- | M- | M- | M- | IIC1 | 1 | OUT | SD | SC | 5V | MIDI4 | MIDI3 | MIDI2 | MIDI1 | IIC2 | 1 | 1 | 1 | 1 | 1 | M- | M+ | M- | M+ | M- | M+ | M- | M+ | IN
tValues: DO | GND | SCLK | 3V3 | GND | DI | CS